# EAGLE board Titan_6L_v1p3 (EAGLE 9.6.2)
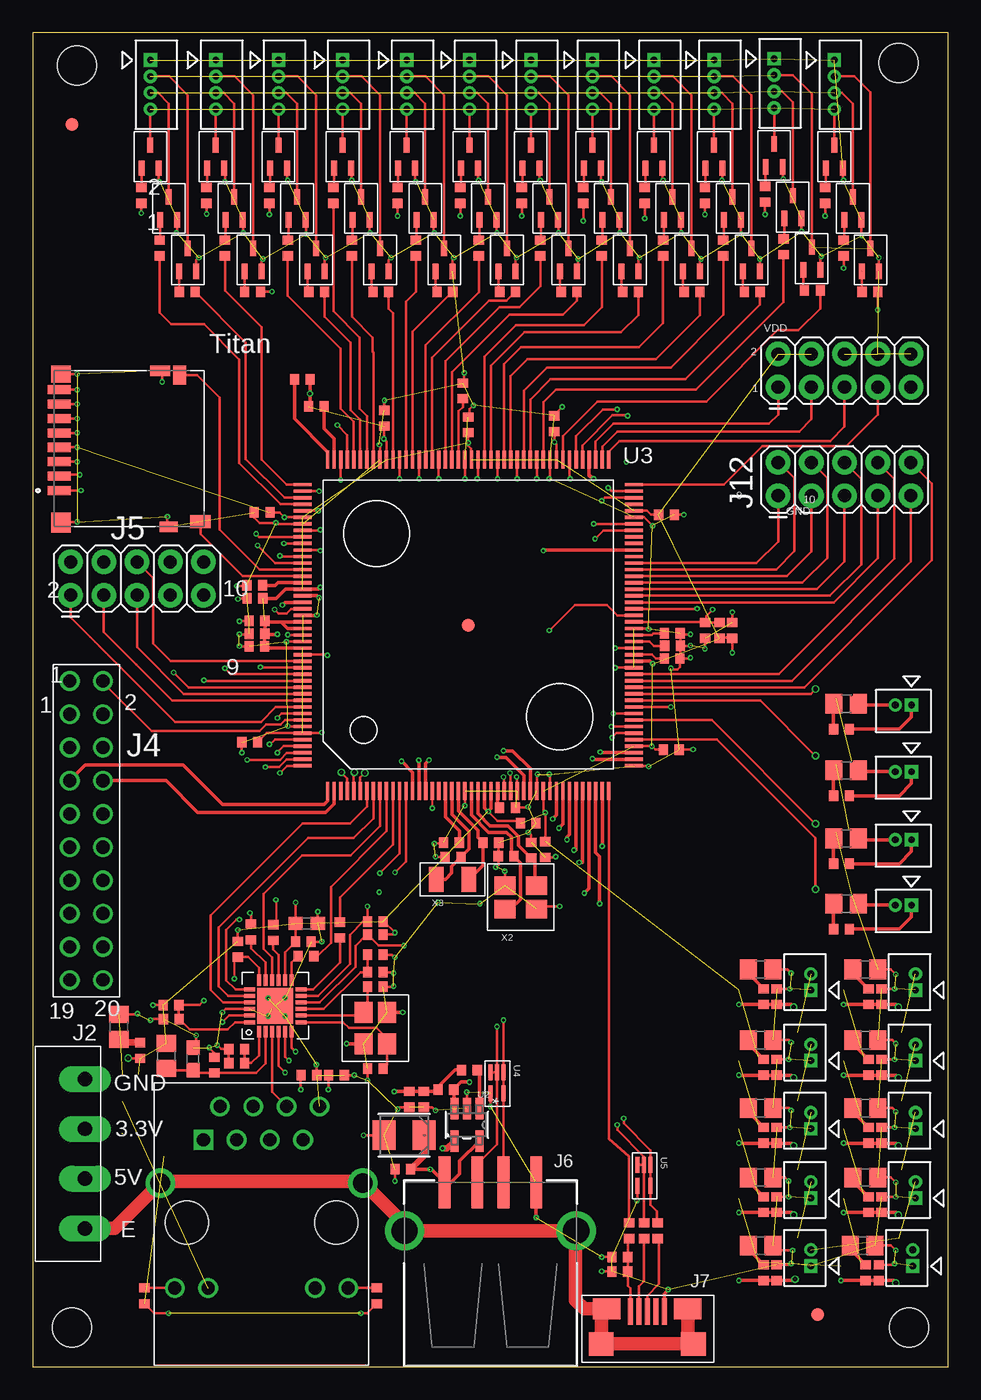
[diagram p7: board, top side]
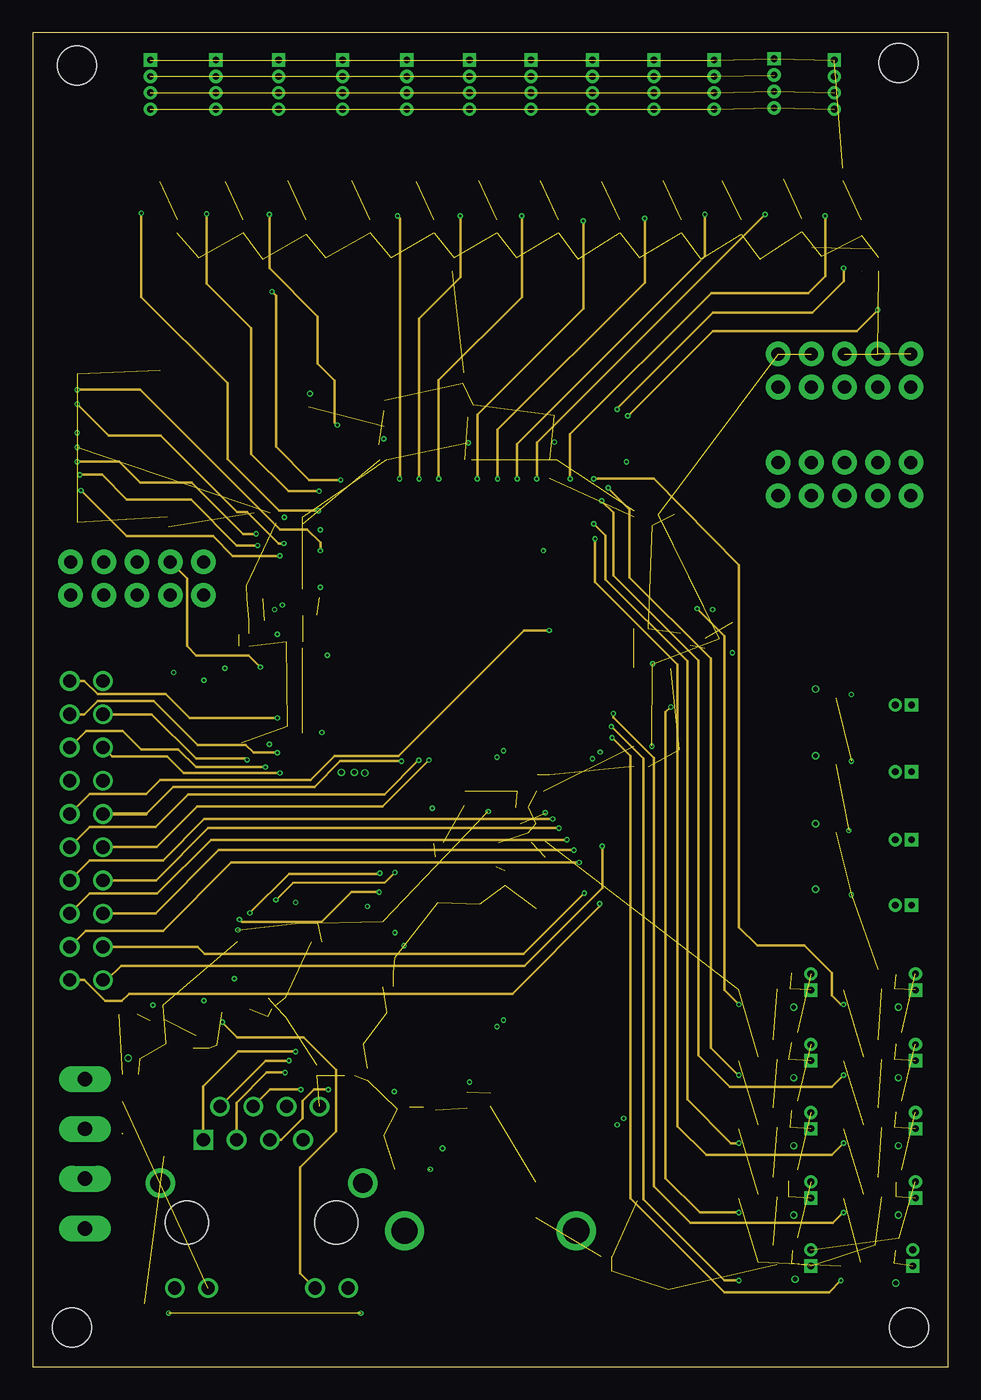
[diagram p8: board, inner layer Route3]
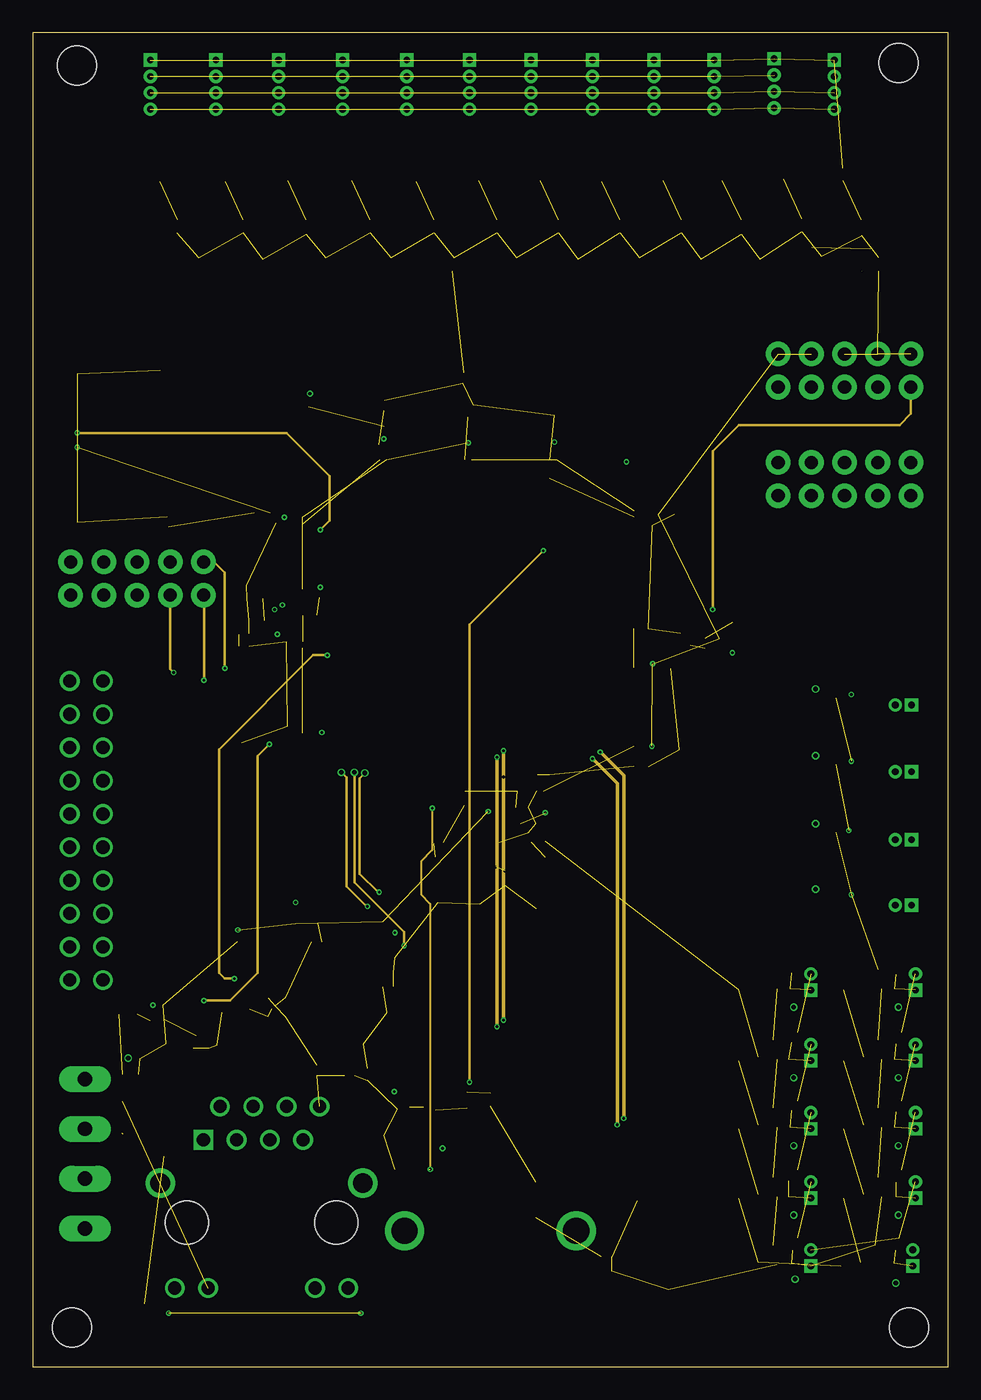
[diagram p9: board, inner layer Route14]
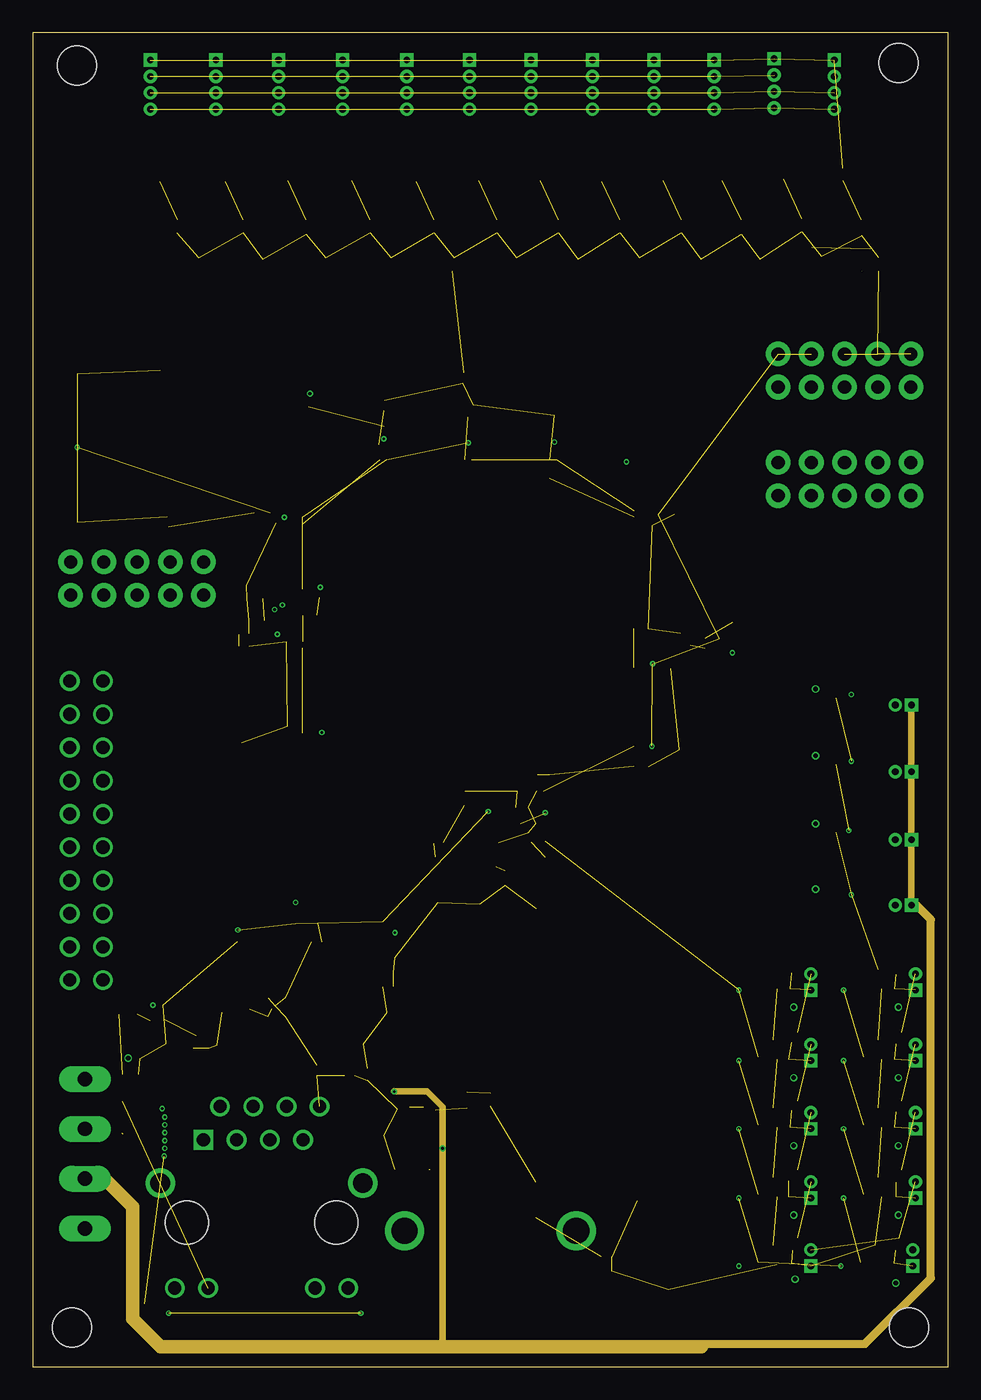
[diagram p10: board, inner layer VDD]
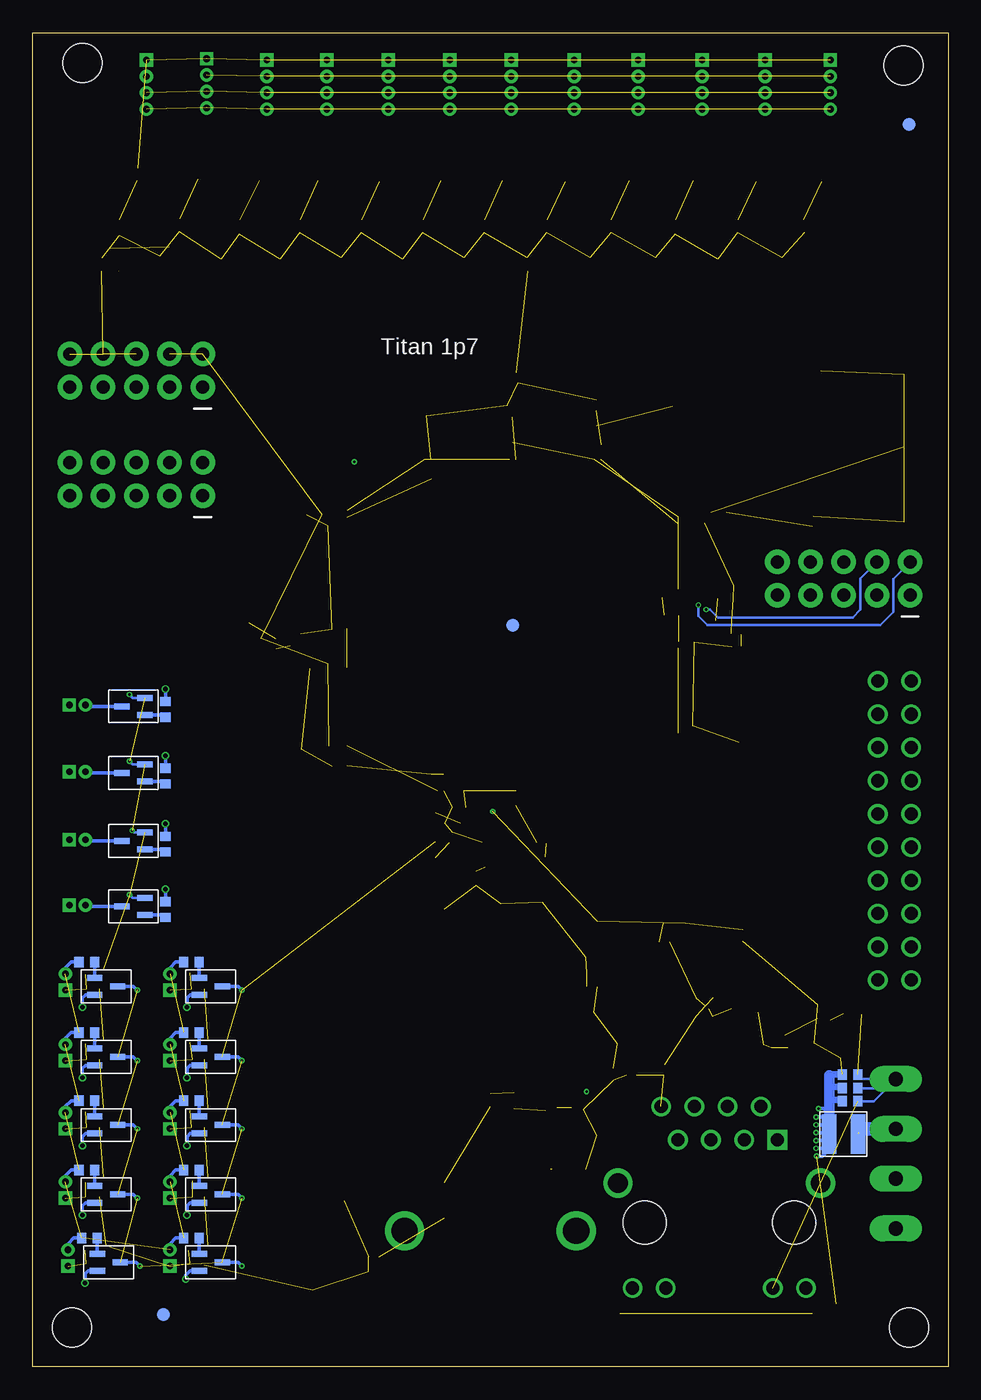
[diagram p11: board, bottom side, seen from below]

Size 70 x 102 mm. Coordinates in mm from the lower left corner, seen from the top.
Outline: 0,0 70,0 70,102 0,102 0,0
Copper layers ([3:[2:[15:1+2*3+14*15+16:2]:15]]): Top 0.0348mm / dielectric 0.1mm / GND 0.0348mm / dielectric 0.546mm / Route3 0.0348mm / dielectric 0.1mm / Route14 0.0348mm / dielectric 0.546mm / VDD 0.0348mm / dielectric 0.1mm / Bottom 0.0348mm
Design rules "default *": minimum track width 6mil, minimum drill 0.2mm, track to track 6mil, track to pad 6mil, pad to pad 6mil, via to via 6mil, smd to smd 6mil, copper to edge 40mil, drill to drill 6mil, minimum pad ring 10mil, minimum via ring 4mil, stop-mask expansion 4mil, vias tented up to drill 0mil, thermal gap 10mil
Holes 3 mm at 3.4,99.5 66.2,99.7 67,3 3,3

## Footprints (pad centres in the part's own frame; a part is rotated, then mirrored left to right if it is on the bottom)
FIDUCIAL_1MM = smd 1 x 1: 1 0,0
CAP_1210TJLJ_3P5X2P8_DIO-M = smd 1.753 x 2.261: 1 -1.537,0; 2 1.537,0
0402 = smd 0.8 x 0.7: P$1 0,0.6; P$2 0,-0.6
0603 = smd 1.1 x 1: 1 -0.85,0; 2 0.85,0
0805 = smd 1.3 x 1.5: 1 -0.95,0; 2 0.95,0
SD_CARD = smd 0.7 x 1.75: 1 3.2,-5.285; 2 2.1,-5.285; 3 1,-5.285; 4 -0.1,-5.285; 5 -1.2,-5.285; 6 -2.3,-5.285; 7 -3.4,-5.285; 8 -4.5,-5.285 | smd 1 x 1.55: 9 5.575,5.515 | smd 1.45 x 1: 10 -5.625,3.94 | smd 1.5 x 1.5: S1 5.65,-5.16 | smd 1.3 x 1.5: S2 -5.7,-5.16 | smd 0.8 x 1.4: S3 5.975,3.09 | smd 0.8 x 1.5: S4 -5.95,2.44
1X4_3.81MM_PITCH = drill 1.1 pad 2 long: P$1 0,0; P$2 3.81,0; P$3 7.62,0; P$4 11.43,0
2X5 = drill 1 pad 1.88: 1 0,0; 2 0,2.54; 3 2.54,0; 4 2.54,2.54; 5 5.08,0; 6 5.08,2.54; 7 7.62,0; 8 7.62,2.54; 9 10.16,0; 10 10.16,2.54
2_X_10_.1_INCH = drill 1: P$1 -11.43,-1.27; P$2 -11.43,1.27; P$3 -8.89,-1.27; P$4 -8.89,1.27; P$5 -6.35,-1.27; P$6 -6.35,1.27; P$7 -3.81,-1.27; P$8 -3.81,1.27; P$9 -1.27,-1.27; P$10 -1.27,1.27; P$11 1.27,-1.27; P$12 1.27,1.27; P$13 3.81,-1.27; P$14 3.81,1.27; P$15 6.35,-1.27; P$16 6.35,1.27; P$17 8.89,-1.27; P$18 8.89,1.27; P$19 11.43,-1.27; P$20 11.43,1.27
USB_A_SMT = smd 4 x 0.9: D+ 6.7,-1; D- 6.7,1; GND 6.7,-3.5; VBUS 6.7,3.5 | drill 2: SHLD1 3,-6.566; SHLD2 3,6.566
USB_MICRO-B = smd 0.4 x 2: P$1 -1.3,2.475; P$2 -0.65,2.475; P$3 0,2.475; P$4 0.65,2.475; P$5 1.3,2.475 | smd 2.1 x 1.6: P$6 -3.1,2.675; P$7 3.1,2.675 | smd 1.9 x 1.8: P$8 -3.525,0; P$9 3.525,0
CON_530470210_MOL = drill 0.508 pad 0.838 square: 1 0,0 | drill 0.508 pad 0.838: 2 -1.245,0
CON_530470410_MOL = drill 0.508 pad 0.838 square: 1 0,0 | drill 0.508 pad 0.838: 2 -1.245,0; 3 -2.489,0; 4 -3.759,0
1008 = smd 3 x 1.1: 1 0,1.1; 2 0,-1.1
SOT-23-5 = smd 1.626 x 0.61: 1 -1.245,0.95; 2 -1.245,0; 3 -1.245,-0.95; 4 1.245,-0.95; 5 1.245,0.95
LQFP176_24X24 = smd 1.372 x 0.254: 1 -12.675,10.75; 2 -12.675,10.25; 3 -12.675,9.75; 4 -12.675,9.25; 5 -12.675,8.75; 6 -12.675,8.25; 7 -12.675,7.75; 8 -12.675,7.25; 9 -12.675,6.75; 10 -12.675,6.25; 11 -12.675,5.75; 12 -12.675,5.25; 13 -12.675,4.75; 14 -12.675,4.25; 15 -12.675,3.75; 16 -12.675,3.25; 17 -12.675,2.75; 18 -12.675,2.25; 19 -12.675,1.75; 20 -12.675,1.25; 21 -12.675,0.75; 22 -12.675,0.25; 23 -12.675,-0.25; 24 -12.675,-0.75; 25 -12.675,-1.25; 26 -12.675,-1.75; 27 -12.675,-2.25; 28 -12.675,-2.75; 29 -12.675,-3.25; 30 -12.675,-3.75; 31 -12.675,-4.25; 32 -12.675,-4.75; 33 -12.675,-5.25; 34 -12.675,-5.75; 35 -12.675,-6.25; 36 -12.675,-6.75; 37 -12.675,-7.25; 38 -12.675,-7.75; 39 -12.675,-8.25; 40 -12.675,-8.75; 41 -12.675,-9.25; 42 -12.675,-9.75; 43 -12.675,-10.25; 44 -12.675,-10.75; 89 12.675,-10.75; 90 12.675,-10.25; 91 12.675,-9.75; 92 12.675,-9.25; 93 12.675,-8.75; 94 12.675,-8.25; 95 12.675,-7.75; 96 12.675,-7.25; 97 12.675,-6.75; 98 12.675,-6.25; 99 12.675,-5.75; 100 12.675,-5.25; 101 12.675,-4.75; 102 12.675,-4.25; 103 12.675,-3.75; 104 12.675,-3.25; 105 12.675,-2.75; 106 12.675,-2.25; 107 12.675,-1.75; 108 12.675,-1.25; 109 12.675,-0.75; 110 12.675,-0.25; 111 12.675,0.25; 112 12.675,0.75; 113 12.675,1.25; 114 12.675,1.75; 115 12.675,2.25; 116 12.675,2.75; 117 12.675,3.25; 118 12.675,3.75; 119 12.675,4.25; 120 12.675,4.75; 121 12.675,5.25; 122 12.675,5.75; 123 12.675,6.25; 124 12.675,6.75; 125 12.675,7.25; 126 12.675,7.75; 127 12.675,8.25; 128 12.675,8.75; 129 12.675,9.25; 130 12.675,9.75; 131 12.675,10.25; 132 12.675,10.75 | smd 0.254 x 1.372: 45 -10.75,-12.675; 46 -10.25,-12.675; 47 -9.75,-12.675; 48 -9.25,-12.675; 49 -8.75,-12.675; 50 -8.25,-12.675; 51 -7.75,-12.675; 52 -7.25,-12.675; 53 -6.75,-12.675; 54 -6.25,-12.675; 55 -5.75,-12.675; 56 -5.25,-12.675; 57 -4.75,-12.675; 58 -4.25,-12.675; 59 -3.75,-12.675; 60 -3.25,-12.675; 61 -2.75,-12.675; 62 -2.25,-12.675; 63 -1.75,-12.675; 64 -1.25,-12.675; 65 -0.75,-12.675; 66 -0.25,-12.675; 67 0.25,-12.675; 68 0.75,-12.675; 69 1.25,-12.675; 70 1.75,-12.675; 71 2.25,-12.675; 72 2.75,-12.675; 73 3.25,-12.675; 74 3.75,-12.675; 75 4.25,-12.675; 76 4.75,-12.675; 77 5.25,-12.675; 78 5.75,-12.675; 79 6.25,-12.675; 80 6.75,-12.675; 81 7.25,-12.675; 82 7.75,-12.675; 83 8.25,-12.675; 84 8.75,-12.675; 85 9.25,-12.675; 86 9.75,-12.675; 87 10.25,-12.675; 88 10.75,-12.675; 133 10.75,12.675; 134 10.25,12.675; 135 9.75,12.675; 136 9.25,12.675; 137 8.75,12.675; 138 8.25,12.675; 139 7.75,12.675; 140 7.25,12.675; 141 6.75,12.675; 142 6.25,12.675; 143 5.75,12.675; 144 5.25,12.675; 145 4.75,12.675; 146 4.25,12.675; 147 3.75,12.675; 148 3.25,12.675; 149 2.75,12.675; 150 2.25,12.675; 151 1.75,12.675; 152 1.25,12.675; 153 0.75,12.675; 154 0.25,12.675; 155 -0.25,12.675; 156 -0.75,12.675; 157 -1.25,12.675; 158 -1.75,12.675; 159 -2.25,12.675; 160 -2.75,12.675; 161 -3.25,12.675; 162 -3.75,12.675; 163 -4.25,12.675; 164 -4.75,12.675; 165 -5.25,12.675; 166 -5.75,12.675; 167 -6.25,12.675; 168 -6.75,12.675; 169 -7.25,12.675; 170 -7.75,12.675; 171 -8.25,12.675; 172 -8.75,12.675; 173 -9.25,12.675; 174 -9.75,12.675; 175 -10.25,12.675; 176 -10.75,12.675
DRL5 = smd 1.219 x 0.305: 1 -0.8,0.5; 2 -0.8,0; 3 -0.8,-0.5; 4 0.8,-0.5; 5 0.8,0.5
QFN-24-M = smd 0.864 x 0.305: 1 -1.968,1.25; 2 -1.968,0.75; 3 -1.968,0.25; 4 -1.968,-0.25; 5 -1.968,-0.75; 6 -1.968,-1.25; 13 1.968,-1.25; 14 1.968,-0.75; 15 1.968,-0.25; 16 1.968,0.25; 17 1.968,0.75; 18 1.968,1.25 | smd 0.305 x 0.864: 7 -1.25,-1.968; 8 -0.75,-1.968; 9 -0.25,-1.968; 10 0.25,-1.968; 11 0.75,-1.968; 12 1.25,-1.968; 19 1.25,1.968; 20 0.75,1.968; 21 0.25,1.968; 22 -0.25,1.968; 23 -0.75,1.968; 24 -1.25,1.968 | smd 2.743 x 2.743: 25 0,0
SOT323 = smd 0.457 x 1.168: 1 -0.65,-0.876; 2 0.65,-0.876; 3 0,0.876
RJ45_TH_ELEC = drill 1 square: 1 -4.45,-2.54 | drill 1: 2 -3.18,0; 3 -1.91,-2.54; 4 -0.635,0; 5 0.635,-2.54; 6 1.91,0; 7 3.17,-2.54; 8 4.445,0; 9 -6.63,-13.88; 10 -4.09,-13.88; 11 4.09,-13.88; 12 6.63,-13.88 | drill 1.5: 13 -7.75,-5.84; 14 7.75,-5.84 | hole 3.299: 5.715,-8.89; -5.715,-8.89
SMD_3225 = smd 1.6 x 1.4: 1 -1.2,-0.9; 2 1.2,-0.9; 3 1.2,0.9; 4 -1.2,0.9
SMD_X_2_PADS = smd 1.9 x 1.1: P$1 0,1.25; P$2 0,-1.25

## Placement (x,y rotation side)
AFID1  FIDUCIAL_1MM  [FIDUCIAL_1MM]  60,4 0 top
AFID2  FIDUCIAL_1MM  [FIDUCIAL_1MM]  3,95 0 top
AFID3  FIDUCIAL_1MM  [FIDUCIAL_1MM]  33.3,56.7 0 top
AFID4  FIDUCIAL_1MM  [FIDUCIAL_1MM]  60,4 0 bottom
AFID5  FIDUCIAL_1MM  [FIDUCIAL_1MM]  3,95 0 bottom
AFID6  FIDUCIAL_1MM  [FIDUCIAL_1MM]  33.3,56.7 0 bottom
C1  TLJT107M010R0900CAP_1210TJLJ_3P5X2P8_DIO-M  [CAP_1210TJLJ_3P5X2P8_DIO-M]  28.4,17.7 180 top
C4  0.1uF  [0402]  7.5,22.35 90 bottom
C5  10uF  [0402]  7.5,21.3 90 bottom
C7  0.1uF  [0402]  7.5,20.3 90 bottom
C13  0.1uF  [0402]  21.13,22.3 90 top
C14  0.1uF  [0402]  23.23,22.3 90 top
C15  24pF  [0402]  26.2,22.8 270 top
C16  10uF  [0402]  51.42,56.3 0 top
C17  18pF  [0402]  36.2,39.03 270 top
C18  18pF  [0402]  38.13,39.5 180 top
C19  0.1uF  [0402]  17,58.75 90 top
C20  0.1uF  [0402]  17.54,65.32 90 top
C21  1uF  [0402]  17.16,56.05 90 top
C22  0.1uF  [0402]  17.15,57.05 90 top
C23  10uF  [0402]  29.9,20.45 0 top
C24  0.1uF  [0402]  16.98,59.74 90 top
C25  0.1uF  [0402]  17.14,55.08 90 top
C26  0.1uF  [0402]  28.8,20.45 0 top
C27  0.1uF  [0402]  16.59,47.75 90 top
C28  1uF  [0402]  44.9,8.4 270 top
C29  0.1uF  [0402]  28.3,15.1 270 top
C30  0.1uF  [0402]  26.87,72.52 0 top
C32  12pF  [0402]  32.14,38.97 270 top
C33  0.1uF  [0402]  32.02,40.07 270 top
C34  0.1uF  [0402]  32.89,74.62 0 top
C35  0.1uF  [0402]  33.3,72.02 0 top
C36  0.1uF  [0402]  37.89,41.56 90 top
C37  12pF  [0402]  35.03,40.07 90 top
C38  0.1uF  [0402]  39.89,72.11 0 top
C39  0.1uF  [0402]  39.19,39.55 0 top
C40  0.1uF  [0402]  53.49,56.3 180 top
C41  1uF  [0402]  48.46,65.14 90 top
C42  0.1uF  [0402]  48.9,54.15 90 top
C43  0.1uF  [0402]  48.84,47.19 270 top
C44  24pF  [0402]  26.2,29.06 90 top
C45  22uF  [0603]  12.26,23.54 90 top
C46  0.1uF  [0402]  13.89,23.07 180 top
C47  2.2uF  [0402]  15.6,23.22 270 top
C48  .1uF  [0402]  15.6,24.3 270 top
C49  100pF  [0402]  26.2,30.16 90 top
C50  22uF  [0603]  20.95,33.9 0 top
C51  0.1uF  [0402]  20.7,32.5 90 top
FB2/2  [0805]  10.22,23.77 270 top
J1  SD_CARD  [SD_CARD]  7.31,70.2 270 top
J2  4-pos  [1X4_3.81MM_PITCH]  4,22 270 top
J3  10-pos  [2X5]  57,74.9 0 top
J4  20-pos  [2_X_10_.1_INCH]  4.1,41 270 top
J5  10-pos  [2X5]  2.9,59 0 top
J6  USB-A  [USB_A_SMT]  35,7.4 90 top
J7  USB-B-Micro  [USB_MICRO-B]  47,1.75 0 top
J9  [CON_530470210_MOL]  67.3,7.7 270 top
J10  CONN_530470410_PICOBLADE_X_4  [CON_530470410_MOL]  9,99.91 90 top
J11  [CON_530470210_MOL]  59.5,18.2 270 top
J12  10-pos  [2X5]  57,66.6 0 top
J13  CONN_530470410_PICOBLADE_X_4  [CON_530470410_MOL]  14,99.91 90 top
J14  CONN_530470410_PICOBLADE_X_4  [CON_530470410_MOL]  18.8,99.91 90 top
J15  CONN_530470410_PICOBLADE_X_4  [CON_530470410_MOL]  23.7,99.91 90 top
J16  CONN_530470410_PICOBLADE_X_4  [CON_530470410_MOL]  28.6,99.91 90 top
J17  CONN_530470410_PICOBLADE_X_4  [CON_530470410_MOL]  47.5,99.91 90 top
J18  CONN_530470410_PICOBLADE_X_4  [CON_530470410_MOL]  33.4,99.91 90 top
J19  CONN_530470410_PICOBLADE_X_4  [CON_530470410_MOL]  61.3,99.91 90 top
J20  CONN_530470410_PICOBLADE_X_4  [CON_530470410_MOL]  38.1,99.91 90 top
J21  CONN_530470410_PICOBLADE_X_4  [CON_530470410_MOL]  52.1,99.91 90 top
J22  CONN_530470410_PICOBLADE_X_4  [CON_530470410_MOL]  42.8,99.91 90 top
J23  [CON_530470210_MOL]  59.5,7.7 270 top
J24  CONN_530470410_PICOBLADE_X_4  [CON_530470410_MOL]  56.7,100.01 90 top
J25  [CON_530470210_MOL]  67.2,35.3 0 top
J26  [CON_530470210_MOL]  67.5,12.9 270 top
J27  [CON_530470210_MOL]  67.5,23.4 270 top
J28  [CON_530470210_MOL]  59.5,12.9 270 top
J30  [CON_530470210_MOL]  67.5,18.2 270 top
J31  [CON_530470210_MOL]  59.5,23.4 270 top
J32  [CON_530470210_MOL]  67.2,40.3 0 top
J33  [CON_530470210_MOL]  67.5,28.8 270 top
J35  [CON_530470210_MOL]  59.5,28.8 270 top
J36  [CON_530470210_MOL]  67.2,45.5 0 top
J38  [CON_530470210_MOL]  67.2,50.6 0 top
L1  2.2uH  [1008]  8,17.8 270 bottom
LED1  Green  [0805]  6.6,26 90 top
LED3  Green  [0805]  63.46,9.28 0 top
LED4  Green  [0805]  55.66,19.78 0 top
LED5  Green  [0805]  55.66,9.28 0 top
LED6  Green  [0805]  62.2,35.4 0 top
LED7  Green  [0805]  63.66,14.48 0 top
LED8  Green  [0805]  63.66,24.98 0 top
LED9  Green  [0805]  55.66,14.48 0 top
LED11  Green  [0805]  63.66,19.78 0 top
LED12  Green  [0805]  55.66,24.98 0 top
LED13  Green  [0805]  62.2,40.4 0 top
LED14  Green  [0805]  63.66,30.38 0 top
LED16  Green  [0805]  55.66,30.38 0 top
LED17  Green  [0805]  62.2,45.6 0 top
LED19  Green  [0805]  62.2,50.7 0 top
R5  470R0  [0402]  8.22,24.19 0 top
R13  10K0  [0402]  52.52,56.3 0 top
R14  1K0  [0402]  20.62,75.5 270 top
R15  1K0  [0402]  21.68,73.43 90 top
R16  15K0  [0402]  45.6,10.4 0 top
R17  27R0  [0402]  46.75,10.4 0 top
R18  27R0  [0402]  47.8,10.4 0 top
R19  10K0  [0402]  31.6,21.2 270 top
R20  10K0  [0402]  33.4,22.7 270 top
R21  30K0  [0402]  44.9,7.3 90 top
R22  2K2  [0402]  36.31,42.75 270 top
R23  10K0  [0402]  48.92,55.12 270 top
R24  10K0  [0402]  48.91,56.08 270 top
R25  470  [0402]  26.31,5.43 0 top
R26  470  [0402]  8.56,5.43 0 top
R27  500R0  [0402]  59.84,34.96 0 bottom
R28  33R0  [0402]  8.3,89.55 180 top
R29  33R0  [0402]  9.71,85.53 180 top
R30  33R0  [0402]  11.82,82.2 270 top
R31  33R0  [0402]  13.3,89.55 180 top
R32  33R0  [0402]  14.71,85.53 180 top
R33  33R0  [0402]  16.82,82.2 270 top
R34  33R0  [0402]  18.1,89.55 180 top
R35  33R0  [0402]  19.51,85.53 180 top
R36  33R0  [0402]  21.72,82.2 270 top
R37  33R0  [0402]  23,89.55 180 top
R38  33R0  [0402]  24.41,85.53 180 top
R39  33R0  [0402]  26.62,82.2 270 top
R40  33R0  [0402]  27.9,89.55 180 top
R41  33R0  [0402]  29.31,85.53 180 top
R42  33R0  [0402]  31.52,82.2 270 top
R43  33R0  [0402]  46.8,89.55 180 top
R44  33R0  [0402]  48.21,85.53 180 top
R45  33R0  [0402]  50.42,82.2 270 top
R46  33R0  [0402]  32.7,89.55 180 top
R47  33R0  [0402]  34.11,85.53 180 top
R48  33R0  [0402]  36.32,82.2 270 top
R49  33R0  [0402]  60.6,89.55 180 top
R50  33R0  [0402]  62.01,85.53 180 top
R51  33R0  [0402]  64.02,82.2 270 top
R52  33R0  [0402]  37.4,89.55 180 top
R53  33R0  [0402]  38.81,85.53 180 top
R54  33R0  [0402]  41.02,82.2 270 top
R55  33R0  [0402]  51.4,89.55 180 top
R56  33R0  [0402]  52.81,85.53 180 top
R57  33R0  [0402]  55.02,82.2 270 top
R58  33R0  [0402]  42.1,89.55 180 top
R59  33R0  [0402]  43.51,85.53 180 top
R60  33R0  [0402]  45.72,82.2 270 top
R61  2.2K  [0402]  65.66,9.85 90 bottom
R62  470R0  [0402]  63.7,7.2 0 top
R63  10K0  [0402]  64.7,7.2 0 top
R64  33R0  [0402]  56,89.65 180 top
R65  33R0  [0402]  57.41,85.63 180 top
R66  33R0  [0402]  59.62,82.3 270 top
R67  2.2K  [0402]  57.86,20.35 90 bottom
R68  470R0  [0402]  55.9,17.7 0 top
R69  10K0  [0402]  56.9,17.7 0 top
R70  2.2K  [0402]  57.86,9.85 90 bottom
R71  470R0  [0402]  55.9,7.2 0 top
R72  10K0  [0402]  56.9,7.2 0 top
R73  470R0  [0402]  61.84,33.46 90 top
R74  6k49  [0402]  26.2,31.51 270 top
R75  10K  [0402]  15.69,31.92 180 top
R76  2.2K  [0402]  65.86,15.05 90 bottom
R77  470R0  [0402]  63.9,12.4 0 top
R78  10K0  [0402]  64.9,12.4 0 top
R79  2.2K  [0402]  65.86,25.55 90 bottom
R80  470R0  [0402]  63.9,22.9 0 top
R81  10K0  [0402]  64.9,22.9 0 top
R82  2.2K  [0402]  57.86,15.05 90 bottom
R83  470R0  [0402]  55.9,12.4 0 top
R84  10K0  [0402]  56.9,12.4 0 top
R85  500R0  [0402]  59.84,39.96 0 bottom
R86  470R0  [0402]  61.84,38.46 90 top
R87  10K  [0402]  10.58,27.66 270 top
R88  2.2K  [0402]  65.86,20.35 90 bottom
R89  470R0  [0402]  63.9,17.7 0 top
R90  10K0  [0402]  64.9,17.7 0 top
R91  2.2K  [0402]  57.86,25.55 90 bottom
R92  470R0  [0402]  55.9,22.9 0 top
R93  10K0  [0402]  56.9,22.9 0 top
R94  1K50  [0402]  26.2,34.04 90 top
R95  500R0  [0402]  59.84,45.16 0 bottom
R96  470R0  [0402]  61.84,43.66 90 top
R97  2.2K  [0402]  65.86,30.95 90 bottom
R98  470R0  [0402]  63.9,28.3 0 top
R99  10K0  [0402]  64.9,28.3 0 top
R100  1K50  [0402]  26.2,33.04 90 top
R101  33  [0402]  23.5,33.4 0 top
R102  500R0  [0402]  59.84,50.26 0 bottom
R103  2.2K  [0402]  57.86,30.95 90 bottom
R104  470R0  [0402]  55.9,28.3 0 top
R105  10K0  [0402]  56.9,28.3 0 top
R106  470R0  [0402]  61.84,48.76 90 top
R107  33  [0402]  20.9,31.4 270 top
R108  33  [0402]  16.7,33.25 0 top
R109  33  [0402]  18.4,33.2 0 top
U2  AP2151DWG-7  [SOT-23-5]  33.2,18.5 270 top
U3  S7G2LQFP176  [LQFP176_24X24]  33.3,56.7 90 top
U4  TVS-Diode  [DRL5]  35.5,21.7 270 top
U5  TVS-Diode  [DRL5]  46.75,14.65 270 top
U6  KSZ8081RNACAQFN-24-M  [QFN-24-M]  18.55,27.6 90 top
U7  NPN  [SOT323]  64.18,7.99 270 bottom
U8  NPN  [SOT323]  56.38,18.49 270 bottom
U9  NPN  [SOT323]  8.99,92.52 0 top
U10  NPN  [SOT323]  10.41,88.57 0 top
U11  NPN  [SOT323]  11.86,84.63 0 top
U12  NPN  [SOT323]  13.99,92.52 0 top
U13  NPN  [SOT323]  15.41,88.57 0 top
U14  NPN  [SOT323]  16.86,84.63 0 top
U15  NPN  [SOT323]  18.79,92.52 0 top
U16  NPN  [SOT323]  20.21,88.57 0 top
U17  NPN  [SOT323]  21.66,84.63 0 top
U18  NPN  [SOT323]  23.69,92.52 0 top
U19  NPN  [SOT323]  25.11,88.57 0 top
U20  NPN  [SOT323]  26.56,84.63 0 top
U21  NPN  [SOT323]  28.59,92.52 0 top
U22  NPN  [SOT323]  30.01,88.57 0 top
U23  NPN  [SOT323]  31.46,84.63 0 top
U24  NPN  [SOT323]  47.49,92.52 0 top
U25  NPN  [SOT323]  48.91,88.57 0 top
U26  NPN  [SOT323]  50.36,84.63 0 top
U27  NPN  [SOT323]  33.39,92.52 0 top
U28  NPN  [SOT323]  34.81,88.57 0 top
U29  NPN  [SOT323]  36.26,84.63 0 top
U30  NPN  [SOT323]  61.29,92.52 0 top
U31  NPN  [SOT323]  62.71,88.57 0 top
U32  NPN  [SOT323]  64.06,84.63 0 top
U33  NPN  [SOT323]  38.09,92.52 0 top
U34  NPN  [SOT323]  39.51,88.57 0 top
U35  NPN  [SOT323]  40.96,84.63 0 top
U36  NPN  [SOT323]  52.09,92.52 0 top
U37  NPN  [SOT323]  53.51,88.57 0 top
U38  NPN  [SOT323]  54.96,84.63 0 top
U39  NPN  [SOT323]  42.79,92.52 0 top
U40  NPN  [SOT323]  44.21,88.57 0 top
U41  NPN  [SOT323]  45.66,84.63 0 top
U42  NPN  [SOT323]  56.38,7.99 270 bottom
U43  NPN  [SOT323]  62.3,35.2 90 bottom
U44  NPN  [SOT323]  64.38,13.19 270 bottom
U45  NPN  [SOT323]  56.69,92.62 0 top
U46  NPN  [SOT323]  58.11,88.67 0 top
U47  NPN  [SOT323]  59.56,84.73 0 top
U48  NPN  [SOT323]  64.38,23.69 270 bottom
U49  NPN  [SOT323]  56.38,13.19 270 bottom
U51  NPN  [SOT323]  64.38,18.49 270 bottom
U52  NPN  [SOT323]  56.38,23.69 270 bottom
U53  NPN  [SOT323]  62.3,40.2 90 bottom
U54  NPN  [SOT323]  64.38,29.09 270 bottom
U56  NPN  [SOT323]  56.38,29.09 270 bottom
U57  NPN  [SOT323]  62.3,45.4 90 bottom
U59  NPN  [SOT323]  62.3,50.5 90 bottom
U$2  [RJ45_TH_ELEC]  17.5,19.9 0 top
U$3  [SMD_3225]  26.2,25.9 270 top
U$4  10uF  [0402]  10.6,26.59 270 top
X2  24MHz  [SMD_3225]  37.31,35.89 0 top
X3  32.768KHz  [SMD_X_2_PADS]  32.1,37.26 90 top

## Tracks (layer width: path | path; a pad name or v marks a point on that pad's centre or on a via)
C58  (via drill 0.2 layers 1-3)
  Top 0.2: v20.5,21.2 20.5,22.31 C13.P$1
  Route3 0.2: U$2.4 18.16,21.2 v20.5,21.2
C60  (via drill 0.2 layers 1-3)
  Top 0.2: C14.P$1 22.63,21.23 v22.6,21.2
  Route3 0.2: v22.6,21.2 v22.59,21.21 21.53,21.21 20.64,20.32 20.64,19 18.99,17.36 U$2.5
CRS_DV
  Top 0.2: U6.15 18.8,31.5 18.4,31.9 R109.P$2
D+
  Top 0.2: R18.P$2 47.9,9.7 47.9,6.35 47,5.44 J7.P$3
D-
  Top 0.2: R17.P$2 46.75,6.55 46.35,6.15 J7.P$2
ESTOP  (via drill 0.2 layers 1-3, 0.35)
  Top 0.2: U3.69 50.78,57.95 v50.8,57.97
  Top 0.254: v58.2,27.5 58,27.7 R105.P$2 R104.P$2 v54,27.7
  Route3 0.2: v50.8,57.97 52.9,55.87 52.9,28.8 v54,27.7
  Bottom 0.254: v58.2,27.5 58.2,28.2 57.96,28.44 U56.2
ETH
  Top 0.2: U6.16 18.3,31.29 17.65,31.95 17.65,36.15 20.6,39.1 24.3,39.1 26.55,41.35 U3.9
ETH_CRS_DV  (via drill 0.2 layers 1-3)
  Top 0.152: v18.6,35.7 18.6,34 R109.P$1
  Top 0.2: v27.7,37.8 28.55,38.65 U3.13
  Route3 0.152: v18.6,35.7 19.9,37 26.9,37 v27.7,37.8
ETH_IRQ14  (via drill 0.2 layers 1-14)
  Top 0.152: v15.43,29.68 15.43,31.06 R75.P$1
  Top 0.2: v22.54,54.41 22.54,54.45 U3.159 | U6.18 17.3,30.5 16.48,31.32 R75.P$1
  Route14 0.2: v15.43,29.68 14.68,29.68 14.25,30.11 14.25,47.22 21.44,54.41 v22.54,54.41
ETH_MDC  (via drill 0.2 layers 1-14, 0.35 layers 1-14)
  Top 0.2: U6.11 21.81,28.35 24.27,30.81 24.27,33.03 25.28,34.04 R94.P$1 v25.6,35.2 | U3.4 24.05,44.99 v23.6,45.44
  Route14 0.2: v25.6,35.2 25.54,35.2 24,36.74 24,45.04 v23.6,45.44
ETH_MDIO  (via drill 0.2 layers 1-14, 0.35 layers 1-14)
  Top 0.2: U6.10 21.95,27.85 24.67,30.57 24.67,32.17 25.54,33.04 R100.P$1 26.44,32.2 v28.4,32.2 | U3.5 24.55,45.39 v24.6,45.44
  Route14 0.2: v28.4,32.2 28.4,33.24 24.6,37.04 v24.6,45.44
ETH_RESET  (via drill 0.2 layers 1-14)
  Top 0.2: U3.172 18.54,47.95 18.2,47.61 v18.1,47.61 | U6.24 15.48,26.35 14.92,25.79 12,25.79 U$4.P$1 11.18,26.61 R87.P$1 12.76,27.66 v13.1,28
  Route14 0.2: v13.1,28 15.1,28 17.2,30.1 17.2,46.71 v18.1,47.61
ETH_RX_ER  (via drill 0.2 layers 1-3)
  Top 0.2: v16.6,34.7 16.7,34.6 R108.P$1 | U3.12 28.05,39.25 v26.55,37.75
  Route3 0.2: v26.55,37.75 26.5,37.7 19.6,37.7 v16.6,34.7
ETH_RXD0
  Top 0.2: R107.P$1 21.8,31.4 22.8,32.4 22.8,36.7 27.05,40.95 U3.10
ETH_RXD1
  Top 0.2: U3.11 27.55,39.95 23.5,35.9 R101.P$1
ETH_TXD0
  Top 0.2: U6.20 14.95,28.35 14.2,29.1 14.2,33.58 21.05,40.42 24.55,40.42 26.05,41.92 U3.8
ETH_TXD1
  Top 0.2: U6.21 14.55,27.85 13.6,28.8 13.6,34.5 20.62,41.52 24.25,41.52 25.55,42.83 U3.7
ETH_TXD_EN  (via drill 0.2 layers 1-14, 0.2 layers 1-3, 0.35 layers 1-14)
  Top 0.2: U6.19 15.5,28.85 14.8,29.55 14.8,33.4 15.6,34.2 v15.8,34.2 | v25.4,45.4 25.05,45.05 U3.6
  Route3 0.2: v15.8,34.2 16,34 22.1,34 24.39,36.29 v26.49,36.29
  Route14 0.2: v26.49,36.29 26.39,36.29 25,37.69 25,45 v25.4,45.4
GND  (via drill 0.2 layers 1-2, 0.2 layers 2-16)  (170 unrouted)
  Top 0.152: U10.2 11.1,87.66 | U12.2 14.7,91.59 | U13.2 16.2,87.56
  Top 0.2: 18.3,27.35 U6.25 | v16,46.95 v15.99,46.96 C27.P$1 | C20.P$1 16.94,64.92 17.34,64.53 v18.6,64.53 18.68,64.45 U3.139 | C43.P$1 50.49,47.19 v50.5,47.2 | C42.P$2 49.5,53.5 49.3,53.3 48.9,53.3 v48.8,53.4 | R23.P$1 49.52,54.17 C42.P$2 | R23.P$1 R24.P$1 49.59,56 v50.3,56 | R22.P$1 37.85,42.75 v37.9,42.8 | C38.P$1 39.89,72.79 v40.5,73.4 | C13.P$2 21.7,22.33 v21.7,23.1 | C14.P$2 v24.6,22.3 | C15.P$2 v25.6,21.9 | U6.22 14.75,27.35 v14.5,27.1 | v14.1,24.6 14.4,24.3 C48.P$2 C47.P$2 | C45.2 12.5,24.63 v12.5,25.34 | C46.P$2 13.89,24.01 v13.5,24.4 | LED1.2 7.95,26.95 v8,27 | U$4.P$2 9.09,26.59 v9,26.5 | C44.P$2 27.56,29.06 v27.6,29.1 | C49.P$2 27.54,30.16 v27.6,30.1 | R74.P$1 27.49,31.51 v27.7,31.3 | C29.P$2 v27.7,14.2 | C1.2 v25.3,17.7 | C26.P$2 28.05,19.85 v27.9,19.7 | C23.P$2 30.55,19.85 v30.8,19.6 | U2.2 v33.2,21 | U4.4 v35,19.9 | C28.P$2 v43.5,8.4 | R21.P$1 v43.5,7.3 | U5.4 46.25,12.75 v46.2,12.7 | 56.9,8.99 LED5.2 56.99,8.9 v58.1,8.9 | 64.7,8.99 LED3.2 65.62,9.28 v66,8.9 | 64.9,14.19 LED7.2 65.62,14.48 v66,14.1 | R72.P$1 57.9,7.8 v58,7.9 | R63.P$1 65.8,7.8 v65.9,7.9 | R84.P$1 v57.8,13 | LED9.2 57.52,14.48 v57.8,14.2 | R78.P$1 v66,13 | R69.P$1 v57.9,18.3 | LED4.2 57.82,19.78 v58,19.6 | R90.P$1 v65.9,18.3 | LED11.2 65.72,19.78 v66,19.5 | R93.P$1 v57.8,23.5 | LED12.2 57.82,24.98 v58,24.8 | LED8.2 65.72,24.98 v66,24.7 | R81.P$1 v65.9,23.5 | R105.P$1 v57.9,28.9 | LED16.2 57.72,30.38 v58,30.1 | LED14.2 65.62,30.38 v66,30 | R99.P$1 v65.9,28.9 | U3.45 47.05,45.95 v47.1,45.9 | U3.60 v44.55,53.45 | U3.63 v44.55,54.95 | v44.55,54.95 | U3.66 47.05,56.45 v47.1,56.4 | v50.3,55.15 50.27,55.12 R23.P$1 | C16.P$2 51.42,54.92 v51.4,54.9 | C40.P$2 53.5,56.91 v53.5,57.7 | U3.83 46.75,64.95 v47.4,64.3
  Top 0.2: C41.P$2 v49.79,65.14 v49.8,65.15 | U3.98 39.55,67.95 v39.5,67.9 | C34.P$1 33,75.33 v33,76 | C35.P$1 33.4,72.72 33.4,73.22 v33.7,73.52 | U3.111 v33.05,67.9 | C30.P$1 26.87,73.87 v26.9,73.9 | U3.124 26.55,70.45 v26.5,70.5 | C24.P$1 16.33,59.7 v15.6,59.7 | C19.P$1 15.75,58.75 v15.7,58.7 | C22.P$1 16.5,57 v15.8,57 | C21.P$1 16.51,56 v15.8,56 | C25.P$1 15.82,55.08 v15.8,55.1 | U3.157 19.42,55.45 v19.4,55.43 | U3.156 19.52,55.95 v19.5,55.97 | U3.170 19.55,48.95 v19.5,49 | U3.22 33.05,42.92 v33.03,42.9 | U3.28 36.05,45.05 v36,45.1 | U3.29 36.55,45.35 v36.5,45.4 | U3.30 37.05,45.05 v37,45.1 | U3.33 38.55,45.25 v38.6,45.3 | U3.35 39.55,45.25 v39.5,45.3 | C39.P$2 39.95,38.95 v40,39 | C18.P$2 38.1,40.13 38.1,40.65 v37.9,40.85 | X2.2 38.72,35.2 v40.3,35.2 | X2.4 v36.11,37.89 v36.1,37.9 | v35.41,38.2 35.6,38.39 C17.P$2 35.63,39.06 C37.P$2 | C33.P$2 31.35,40 v30.7,40 | C32.P$2 30.83,38.97 v30.8,39 | C51.P$2 v22.1,32.5 | C50.2 v21.8,34.8 | U32.2 64.71,84.79 v64.7,84.8 | U47.2 60.21,84.81 v60.3,84.9 | U38.2 55.61,84.69 v55.6,84.7 | U31.2 63.36,86.54 v63.4,86.5 | U46.2 58.76,86.84 v58.8,86.8 | U37.2 54.16,86.64 v54.2,86.6 | U25.2 49.56,86.74 v49.6,86.7 | U40.2 44.86,86.74 v44.9,86.7 | U41.2 46.31,84.71 v46.4,84.8 | U26.2 51.01,84.61 v51.1,84.7 | U24.2 48.14,90.76 v48.2,90.7 | U36.2 52.74,90.74 v52.7,90.7 | U45.2 57.34,90.86 v57.4,90.8 | U30.2 61.94,90.76 v62,90.7 | U39.2 43.44,90.66 v43.5,90.6 | U33.2 38.74,90.76 v38.8,90.7 | U27.2 34.04,90.76 v34.1,90.7 | U21.2 29.24,90.66 v29.3,90.6 | U18.2 24.4,91.59 v24.4,90.7 | U15.2 19.44,90.76 v19.5,90.7 | 14.7,91.59 v14.7,90.6 | U13.2 16.1,87.66 v16.1,86.7 | U16.2 20.9,87.66 v20.9,86.6 | U19.2 25.76,86.74 v25.8,86.7
  Top 0.2: U22.2 30.66,86.74 v30.7,86.7 | U28.2 35.46,86.74 v35.5,86.7 | U34.2 40.2,87.66 v40.2,86.7 | U35.2 41.7,83.84 v41.7,84.7 | U29.2 36.91,84.71 v37,84.8 | U23.2 32.11,84.71 v32.2,84.8 | U20.2 27.21,84.61 v27.4,84.8 | U17.2 22.31,84.71 v22.4,84.8 | U14.2 17.51,84.61 v17.6,84.7 | U11.2 12.51,84.61 v12.7,84.8 | U9.2 9.64,90.66 v9.7,90.6 | U10.2 11.06,86.76 v11,86.7 | J1.6 v3.4,72.5 | J1.S2 v3.4,75.9 | J1.S4 9.9,76 v9.9,75.3 | J1.S1 2.2,64.6 v3.4,64.6 | J1.S3 10.3,64.33 v10.3,65 | C42.P$2 50.25,54.15 v50.3,54.2
  Top 0.254: U3.153 21.69,57.45 v21.72,57.48 | U3.150 21.75,58.95 v21.9,58.8 | U6.22 16.55,27.32 | U$3.4 v28.3,27.1 | U$3.2 v24,24.7 | J6.GND v38.5,11.4 | J7.P$5 48.3,5.6 v48.6,5.9
  Bottom 0.2: C4.P$2 6.55,22 J2.P$1 | C5.P$2 4.7,21.3 J2.P$1 | C7.P$2 5.7,20.3 J2.P$1 | U43.2 62.35,35.85 v62.6,36.1 | U53.2 62.25,40.85 v62.4,41 | U57.2 62.35,46.05 v62.6,46.3 | U59.2 62.35,51.15 v62.6,51.4
  other vias: 31,35.5 34.2,35.4 18,26.8 19.3,26.8 18,28.2 19.3,28.2
GNDE
  Top 1.016: J7.P$7 50.1,2.17 J7.P$9 J7.P$8 43.48,4.42 J7.P$6 42.17,4.42 41.5,5.1 41.5,10.33 J6.SHLD1 J6.SHLD2 28.43,10.88 U$2.14 24.65,14.06 24.53,14.18 10.47,14.18 10.35,14.06 U$2.13 6.26,10.57 J2.P$4
IIC_1_SCL
  Top 0.254: U3.132 22.55,69.95 20.02,72.48 R14.P$2
IIC_1_SDA
  Top 0.254: U3.131 23.05,70.95 22.29,71.72 R15.P$2
LED1/SPEED  (via drill 0.2 layers 1-3)
  Top 0.2: U6.23 15,26.85 v14.5,26.35
  Route3 0.2: v14.5,26.35 15.65,25.2 20.7,25.2 23.2,22.7 23.2,18 20.45,15.25 20.45,7.15 U$2.11
LS_01  (via drill 0.2 layers 1-3, 0.35)
  Top 0.2: U3.50 44.65,48.45 v44.3,48.1
  Top 0.254: v66,6.4 65.8,6.6 R63.P$2 R62.P$2 v61.8,6.6
  Route3 0.2: v61.8,6.6 60.9,5.7 52.9,5.7 45.7,12.9 45.7,46.7 v44.3,48.1
  Bottom 0.254: v66,6.4 66,7.1 65.76,7.34 U7.2
LS_02  (via drill 0.2 layers 1-3, 0.35)
  Top 0.2: U3.51 v44.25,48.95
  Top 0.254: v58.3,6.7 58.2,6.6 R72.P$2 R71.P$2 v54,6.6
  Route3 0.2: v54,6.6 52.9,6.6 46.7,12.8 46.7,46.5 v44.25,48.95
  Bottom 0.254: v58.3,6.7 58.3,7 57.96,7.34 U42.2
LS_03  (via drill 0.2 layers 1-3, 0.35)
  Top 0.2: U3.53 v44.4,49.95
  Top 0.254: v66.2,11.6 66,11.8 R78.P$2 R77.P$2 v62,11.8
  Route3 0.2: v62,11.8 61.2,11 50.3,11 47.5,13.8 47.5,46.55 44.4,49.65 v44.4,49.95
  Bottom 0.254: v66.2,11.6 66.2,12.3 65.96,12.54 U44.2
LS_04  (via drill 0.2 layers 1-3, 0.35)
  Top 0.2: U3.54 v48.8,50.45
  Top 0.254: v58.2,11.6 58,11.8 R84.P$2 R83.P$2 v54,11.8
  Route3 0.2: v48.8,50.45 48.4,50.05 48.4,14.4 51,11.8 v54,11.8
  Bottom 0.254: v58.2,11.6 58.2,12.3 57.96,12.54 U49.2
LS_05  (via drill 0.2 layers 1-3, 0.35)
  Top 0.2: U3.81 43.65,63.95 v43,63.3
  Top 0.254: v66.2,16.9 66,17.1 R90.P$2 R89.P$2 v62,17.1
  Route3 0.2: v43,63.3 43,60 49.3,53.7 49.3,18.4 51.5,16.2 61.1,16.2 v62,17.1
  Bottom 0.254: v66.2,16.9 66.2,17.6 65.96,17.84 U51.2
LS_06  (via drill 0.2 layers 1-3, 0.35)
  Top 0.2: U3.82 v42.9,64.45
  Top 0.254: v58.2,16.9 58,17.1 R69.P$2 R68.P$2 v54,17.1
  Route3 0.2: v42.9,64.45 43.8,63.55 43.8,60.2 50.05,53.95 50.05,20.45 53.4,17.1 v54,17.1
  Bottom 0.254: v58.2,16.9 58.2,17.6 57.96,17.84 U8.2
LS_07  (via drill 0.2 layers 1-3, 0.35)
  Top 0.2: U3.86 43.75,66.45 v43.5,66.2
  Top 0.254: v66.2,22.1 66,22.3 R81.P$2 R80.P$2 v62,22.3
  Route3 0.2: v43.5,66.2 44.4,65.3 44.4,60.5 50.9,54 50.9,23.8 53.3,21.4 61.1,21.4 v62,22.3
  Bottom 0.254: v66.2,22.1 66.2,22.8 65.96,23.04 U48.2
LS_08  (via drill 0.2 layers 1-3, 0.35)
  Top 0.2: U3.87 44.25,66.95 v44,67.2
  Top 0.254: v58.2,22.1 58,22.3 R93.P$2 R92.P$2 v54,22.3
  Route3 0.2: v54,22.3 53.95,22.3 51.85,24.4 51.85,54.15 45.65,60.35 45.65,65.55 v44,67.2
  Bottom 0.254: v58.2,22.1 58.2,22.8 57.96,23.04 U52.2
LS_09  (via drill 0.2 layers 1-3, 0.35)
  Top 0.254: U3.92 42.55,68.15 v42.9,67.9 | v66.2,27.5 66,27.7 R99.P$2 R98.P$2 v62,27.7
  Route3 0.2: v62,27.7 61.8,27.7 61.1,28.4 61.1,30.1 59,32.2 55.4,32.2 54,33.6 54,61.3 47.5,67.9 v42.9,67.9
  Bottom 0.254: v66.2,27.5 66.2,28.2 65.96,28.44 U54.2
LS_RET  (9 unrouted)
  Bottom 0.254: J9.2 67.3,9.41 66.86,9.85 R61.P$1 | J23.2 59.5,9.41 59.06,9.85 R70.P$1 | J26.2 67.5,14.61 67.06,15.05 R76.P$1 | J28.2 59.5,14.61 59.06,15.05 R82.P$1 | J30.2 67.5,19.91 67.06,20.35 R88.P$1 | J11.2 59.5,19.91 59.06,20.35 R67.P$1 | J27.2 67.5,25.11 67.06,25.55 R79.P$1 | J31.2 59.5,25.11 59.06,25.55 R91.P$1 | J33.2 67.5,30.51 67.06,30.95 R97.P$1 | J35.2 59.5,30.51 59.06,30.95 R103.P$1
M1_DIR
  Top 0.2: U3.136 18.95,65.95 15.8,69.1 15.8,77 13.1,79.7 10.6,79.7 9.71,80.59 R29.P$1
M1_ENABLE
  Top 0.2: U3.135 19.25,66.45 16.3,69.4 16.3,78.32 R30.P$1
M1_STEP  (via drill 0.2 layers 1-3)
  Top 0.2: U3.137 v21.85,65.45 | v8.3,88.2 R28.P$1
  Route3 0.2: v21.85,65.45 18.85,65.45 14.9,69.4 14.9,75.2 8.3,81.8 v8.3,88.2
M2_DIR
  Top 0.2: U3.133 19.43,67.45 17.5,69.38 17.5,79.5 14.71,82.29 R32.P$1
M2_ENABLE  (via drill 0.2 layers 1-3)
  Top 0.2: U3.130 v23.55,67.8 | v18.3,82.2 R33.P$1
  Route3 0.2: v23.55,67.8 21.15,67.8 18.6,70.35 18.6,81.9 v18.3,82.2
M2_STEP  (via drill 0.2 layers 1-3)
  Top 0.2: U3.134 v21.9,66.95 | v13.3,88.15 R31.P$1
  Route3 0.2: v21.9,66.95 19.55,66.95 16.7,69.8 16.7,79.4 13.3,82.8 v13.3,88.15
M3_DIR
  Top 0.2: U3.128 24.55,72.25 23.55,73.25 23.55,77.85 19.51,81.89 R35.P$1
M3_ENABLE
  Top 0.2: U3.127 25.05,72.4 24.3,73.15 24.3,78.3 22.32,80.28 R36.P$1
M3_STEP  (via drill 0.2 layers 1-3)
  Top 0.2: U3.129 24.05,71.25 v23.3,72 | v18.1,88.1 R34.P$1
  Route3 0.2: v23.3,72 23.1,72.2 23.1,75.4 21.8,76.7 21.8,80.3 18.1,84 v18.1,88.1
M4_DIR
  Top 0.2: U3.125 26.05,77.55 26,77.6 26,78.7 24.41,80.29 R38.P$1
M4_ENABLE
  Top 0.2: R39.P$1 27.22,80.9 27.55,80.57 U3.122
M4_STEP
  Top 0.2: U3.126 25.55,72.7 25,73.25 25,78.7 23,80.7 R37.P$1
M5_DIR
  Top 0.2: R41.P$1 29.31,82.21 28.55,81.45 U3.120
M5_ENABLE
  Top 0.2: R42.P$1 29.05,79.13 U3.119
M5_STEP  (via drill 0.2 layers 1-3)
  Top 0.2: U3.121 v28.05,67.9 | v27.9,88 R40.P$1
  Route3 0.2: v28.05,67.9 28.1,67.95 28.1,87.8 v27.9,88
M6_DIR
  Top 0.2: U3.117 30.05,78.1 34.11,82.16 R47.P$1
M6_ENABLE
  Top 0.2: U3.116 30.55,77.15 34.9,81.5 36.22,81.5 R48.P$1
M6_STEP  (via drill 0.2 layers 1-3)
  Top 0.2: U3.118 v29.55,67.9 | v32.7,88 R46.P$1
  Route3 0.2: v32.7,88 32.7,83.3 29.55,80.15 v29.55,67.9
M7_DIR
  Top 0.2: U3.114 31.55,76.9 35.68,81.03 37.21,81.03 38.81,82.63 R53.P$1
M7_ENABLE
  Top 0.2: U3.113 32.05,76.05 36.45,80.45 40.55,80.45 41.62,81.52 R54.P$1
M7_STEP  (via drill 0.2 layers 1-3)
  Top 0.2: U3.115 v31.05,67.9 | v37.4,88 R52.P$1
  Route3 0.2: v31.05,67.9 31.05,75.45 37.4,81.8 v37.4,88
M8_DIR
  Top 0.2: R59.P$1 43.51,81.01 42.15,79.65 36.95,79.65 34.55,77.25 U3.108
M8_ENABLE
  Top 0.2: R60.P$1 46.32,80.42 45,79.1 37.6,79.1 35.05,76.55 U3.107
M8_STEP  (via drill 0.2 layers 1-3)
  Top 0.2: U3.109 34.05,67.95 v34,67.9 | v42.1,87.6 R58.P$1
  Route3 0.2: v34,67.9 34,72.8 42.1,80.9 v42.1,87.6
M9_DIR
  Top 0.2: R44.P$1 48.21,79.81 46.35,77.95 37.35,77.95 36.05,76.65 U3.105
M9_ENABLE
  Top 0.2: R45.P$1 51.02,80.4 47.67,77.05 37.85,77.05 36.55,75.75 U3.104
M9_STEP  (via drill 0.2 layers 1-3)
  Top 0.2: U3.106 v35.55,67.9 | v46.8,87.8 R43.P$1
  Route3 0.2: v35.55,67.9 35.55,71.65 46.8,82.9 v46.8,87.8
M10_DIR
  Top 0.2: R56.P$1 52.83,84.91 52.83,80.43 48.81,76.41 39.31,76.41 37.55,74.65 U3.102
M10_ENABLE
  Top 0.2: R57.P$1 55.62,81.2 49.92,75.5 39.6,75.5 38.05,73.95 U3.101
M10_STEP  (via drill 0.2 layers 1-3)
  Top 0.2: U3.103 v37.05,67.9 | v51.4,88.1 R55.P$1
  Route3 0.2: v37.05,67.9 37.05,70.55 51.4,84.9 v51.4,88.1
M11_DIR
  Top 0.2: R65.P$1 57.41,81.41 50.7,74.7 40,74.7 39.05,73.75 U3.99
M11_ENABLE
  Top 0.2: U3.96 40.55,71.15 43.2,73.8 51.5,73.8 56.95,79.25 58.55,79.25 60.22,80.92 R66.P$1
M11_STEP  (via drill 0.2 layers 1-3)
  Top 0.2: U3.100 v38.55,67.9 | v56,88.1 R64.P$1
  Route3 0.2: v38.55,67.9 38.55,70.65 v56,88.1
M12_DIR  (via drill 0.2 layers 1-3)
  Top 0.2: U3.94 41.55,71.15 43.6,73.2 v44.7,73.2 | v62.01,84 R50.P$1
  Route3 0.2: v44.7,73.2 44.7,73.28 52.02,80.6 59.61,80.6 62.01,83 v62.01,84
M12_ENABLE  (via drill 0.2 layers 1-3)
  Top 0.2: U3.93 42.05,70.45 44.35,72.75 45.45,72.75 v45.5,72.7 | v64.62,80.8 R51.P$1
  Route3 0.2: v45.5,72.7 45.52,72.7 52.02,79.2 63.02,79.2 v64.62,80.8
M12_STEP  (via drill 0.2 layers 1-3)
  Top 0.2: U3.95 41.05,68.05 v41.1,67.9 | v60.6,88 R49.P$1
  Route3 0.2: v60.6,88 60.6,83.4 59.3,82.1 51.9,82.1 41.1,71.3 v41.1,67.9
MO_DIR  (11 unrouted)
  Top 0.2: U10.3 10.41,96.59 9.58,97.42 J10.3 | U13.3 15.41,96.59 14.58,97.42 J13.3 | U16.3 20.21,96.59 19.38,97.42 J14.3 | U19.3 25.11,96.59 24.28,97.42 J15.3 | U22.3 30.01,96.59 29.18,97.42 J16.3 | U28.3 34.81,96.59 33.98,97.42 J18.3 | U34.3 39.51,96.59 38.68,97.42 J20.3 | U40.3 44.21,96.59 43.38,97.42 J22.3 | U25.3 48.91,96.59 48.08,97.42 J17.3 | U37.3 53.51,96.59 52.68,97.42 J21.3 | U46.3 58.11,96.69 57.28,97.52 J24.3 | U31.3 62.71,96.59 61.88,97.42 J19.3
MO_ENABLE  (11 unrouted)
  Top 0.2: 11.86,88.21 U11.3 11.86,97.24 10.44,98.66 J10.2 | 16.86,88.21 U14.3 16.86,97.24 15.44,98.66 J13.2 | 21.66,88.21 U17.3 21.66,97.24 20.24,98.66 J14.2 | 26.56,88.21 U20.3 26.56,97.24 25.14,98.66 J15.2 | 31.46,88.21 U23.3 31.46,97.24 30.04,98.66 J16.2 | 36.26,88.21 U29.3 36.26,97.24 34.84,98.66 J18.2 | 40.96,88.21 U35.3 40.96,97.24 39.54,98.66 J20.2 | 45.66,88.21 U41.3 45.66,97.24 44.24,98.66 J22.2 | 50.36,88.21 U26.3 50.36,97.24 48.94,98.66 J17.2 | 54.96,88.21 U38.3 54.96,97.24 53.54,98.66 J21.2 | 59.56,88.31 U47.3 59.56,97.34 58.14,98.76 J24.2 | U32.3 64.06,97.44 62.84,98.66 J19.2
MO_STEP  (11 unrouted)
  Top 0.2: U9.3 J10.4 | U12.3 J13.4 | U15.3 J14.4 | U18.3 J15.4 | U21.3 J16.4 | U27.3 J18.4 | U33.3 J20.4 | U39.3 J22.4 | U24.3 J17.4 | U36.3 J21.4 | U45.3 J24.4 | U30.3 J19.4
N$1
  Top 0.254: U3.148 18.75,59.95 18.54,59.74 C24.P$2
N$3
  Top 0.508: R5.P$1 6.86,24.79 LED1.1
N$4
  Top 0.254: C33.P$1 32.62,40.97 31.55,42.05 U3.19
N$5
  Top 0.2: U3.62 47.35,54.45 47.65,54.15 C42.P$1
N$6
  Top 0.2: U3.64 47.15,55.45 47.5,55.1 48.3,55.1 R23.P$2
N$7
  Top 0.2: U3.65 47.35,55.95 47.48,56.08 R24.P$2
N$8
  Top 0.254: U3.27 35.55,42.91 R22.P$2
N$11
  Bottom 0.254: U7.1 R61.P$2
N$12
  Top 0.2: U10.1 9.76,86.19 R29.P$2
N$13
  Top 0.2: U11.1 11.21,82.3 R30.P$2
N$14
  Top 0.2: U9.1 8.34,90.2 R28.P$2
N$15
  Top 0.2: U13.1 14.76,86.19 R32.P$2
N$16
  Top 0.2: U14.1 16.21,82.3 R33.P$2
N$17
  Top 0.2: U12.1 13.34,90.2 R31.P$2
N$18
  Top 0.2: U16.1 19.56,86.19 R35.P$2
N$19
  Top 0.2: U17.1 21.01,82.3 R36.P$2
N$20
  Top 0.2: U15.1 18.14,90.2 R34.P$2
N$21
  Top 0.2: U19.1 24.46,86.19 R38.P$2
N$22
  Top 0.2: U20.1 25.91,82.3 R39.P$2
N$23
  Top 0.2: U18.1 23.04,90.2 R37.P$2
N$24
  Top 0.2: U22.1 29.36,86.19 R41.P$2
N$25
  Top 0.2: U23.1 30.81,82.3 R42.P$2
N$26
  Top 0.2: U21.1 27.94,90.2 R40.P$2
N$27
  Top 0.2: U25.1 48.26,86.19 R44.P$2
N$28
  Top 0.2: U26.1 49.71,82.3 R45.P$2
N$29
  Top 0.2: U24.1 46.84,90.2 R43.P$2
N$30
  Top 0.2: U28.1 34.16,86.19 R47.P$2
N$31
  Top 0.2: U29.1 35.61,82.3 R48.P$2
N$32
  Top 0.2: U27.1 32.74,90.2 R46.P$2
N$33
  Top 0.2: U31.1 62.06,86.19 R50.P$2
N$34  (1 unrouted)
  Top 0.2: R51.P$2 U32.1
N$35
  Top 0.2: U30.1 60.64,90.2 R49.P$2
N$36
  Top 0.2: U34.1 38.86,86.19 R53.P$2
N$37
  Top 0.2: U35.1 40.31,82.3 R54.P$2
N$38
  Top 0.2: U33.1 37.44,90.2 R52.P$2
N$39
  Top 0.2: U37.1 52.86,86.19 R56.P$2
N$40
  Top 0.2: U38.1 54.31,82.3 R57.P$2
N$41
  Top 0.2: U36.1 51.44,90.2 R55.P$2
N$42
  Top 0.2: U40.1 43.56,86.19 R59.P$2
N$43
  Top 0.2: U41.1 45.01,82.3 R60.P$2
N$44
  Top 0.2: U39.1 42.14,90.2 R58.P$2
N$45
  Top 0.254: R62.P$1 62.51,8.99 LED3.1
N$46
  Bottom 0.254: U8.1 R67.P$2
N$47
  Top 0.254: R68.P$1 54.71,19.49 LED4.1
N$48
  Top 0.2: U46.1 57.46,86.29 R65.P$2
N$49
  Top 0.2: U47.1 58.91,82.4 R66.P$2
N$50
  Top 0.2: U45.1 56.04,90.3 R64.P$2
N$51
  Bottom 0.254: U42.1 R70.P$2
N$52
  Top 0.254: R71.P$1 54.71,8.99 LED5.1
N$54
  Bottom 0.254: U43.1 60.03,34.55 R27.P$2
N$55
  Bottom 0.254: U44.1 R76.P$2
N$56
  Top 0.254: R77.P$1 62.71,14.19 LED7.1
N$57
  Bottom 0.254: U48.1 R79.P$2
N$58
  Top 0.254: R80.P$1 62.71,24.69 LED8.1
N$59
  Bottom 0.254: U49.1 R82.P$2
N$60
  Top 0.254: R83.P$1 54.71,14.19 LED9.1
N$61
  Top 0.254: J25.2 63.25,35.3 LED6.2
  Bottom 0.254: U43.3 65.86,35.2 J25.2
N$62
  Top 0.254: R73.P$1 LED6.1
N$63
  Bottom 0.254: U51.1 R88.P$2
N$64
  Top 0.254: R89.P$1 62.71,19.49 LED11.1
N$65
  Bottom 0.254: U52.1 R91.P$2
N$66
  Top 0.254: R92.P$1 54.71,24.69 LED12.1
N$68  (via drill 0.2)
  other vias: 45.4,69.2
N$69
  Bottom 0.254: U54.1 R97.P$2
N$70
  Top 0.254: R98.P$1 62.71,30.09 LED14.1
N$72
  Bottom 0.254: U53.1 60.03,39.55 R85.P$2
N$73
  Bottom 0.254: U56.1 R103.P$2
N$74
  Top 0.254: R104.P$1 54.71,30.09 LED16.1
N$75
  Top 0.254: J32.2 63.25,40.3 LED13.2
  Bottom 0.254: U53.3 65.86,40.2 J32.2
N$76
  Top 0.254: R86.P$1 LED13.1
N$80
  Bottom 0.254: U57.1 60.03,44.75 R95.P$2
N$81
  Top 0.254: J36.2 63.25,45.5 LED17.2
  Bottom 0.254: U57.3 65.86,45.4 J36.2
N$82
  Top 0.254: R96.P$1 LED17.1
N$86
  Bottom 0.254: U59.1 60.03,49.85 R102.P$2
N$87
  Top 0.254: J38.2 63.25,50.6 LED19.2
  Bottom 0.254: U59.3 65.86,50.5 J38.2
N$88
  Top 0.254: R106.P$1 LED19.1
P0_00
  Top 0.2: U3.169 19.3,49.45 18.95,49.1 17.86,49.1 17.36,48.6 9.1,48.6 5.37,52.33 J4.P$2
P0_01  (via drill 0.2 layers 1-3)
  Top 0.2: U3.168 19.05,49.95 v18.7,49.6
  Route3 0.2: v18.7,49.6 12,49.6 10.18,51.42 4.95,51.42 3.95,52.43 J4.P$1
P0_02
  Top 0.2: J5.1 2.9,57.3 10.9,49.3 17.46,49.3 18.59,50.43 20.55,50.43 20.57,50.45 U3.167
P0_03
  Top 0.2: U3.166 10.65,50.95 7.9,53.7 5.44,56.16 J5.3
P0_04
  Top 0.2: U3.165 11.55,51.45 7.98,55.02 J5.5
P0_05  (via drill 0.2 layers 1-14)
  Top 0.2: U3.164 11.91,51.95 v10.78,53.08
  Route14 0.2: v10.78,53.08 10.52,53.34 J5.7
P0_06  (via drill 0.2 layers 1-14)
  Top 0.2: U3.163 13.15,52.45 v13.1,52.5
  Route14 0.2: v13.1,52.5 13.1,58.96 J5.9
P0_07  (via drill 0.2 layers 1-14)
  Top 0.2: U3.162 15.15,52.95 v14.7,53.4
  Route14 0.2: v14.7,53.4 14.67,53.43 14.67,60.73 13.86,61.54 J5.10
P0_08  (via drill 0.2 layers 1-3)
  Top 0.2: U3.161 17.45,53.45 v17.4,53.5
  Route3 0.2: v17.4,53.5 16.5,54.4 12.5,54.4 11.8,55.1 11.8,60.26 J5.8
P0_09
  Top 0.2: U3.160 10.55,53.95 9.2,55.3 9.2,60.32 J5.6
P0_14  (via drill 0.2)
  Top 0.2: v18.5,57.9 18.8,57.6 19.4,57.6 19.75,57.95 U3.152
  Bottom 0.2: v18.5,57.9 18.2,57.9 17.6,57.3 7.3,57.3 6.7,57.9 6.7,60.28 J5.4
P0_15  (via drill 0.2)
  Top 0.254: v19.1,58.24 19.31,58.45 U3.151
  Bottom 0.2: J5.2 4.2,60.24 4.2,57.7 5.2,56.7 18.4,56.7 19.1,57.4 v19.1,58.24
P2_01  (via drill 0.2 layers 1-3)
  Top 0.2: U3.68 44.73,57.45 43.92,58.26 41.46,58.26 v39.5,56.3
  Route3 0.2: J4.P$9 4.36,43.8 8.69,43.8 9.74,44.85 21.25,44.85 23.1,46.7 27.97,46.7 37.57,56.3 v39.5,56.3
P3_10
  Top 0.2: U3.76 55.35,61.45 57,63.1 J12.1
P3_11
  Top 0.2: U3.75 56.85,60.95 58.25,62.35 58.25,67.95 57.06,69.14 J12.2
P3_12
  Top 0.2: U3.74 57.65,60.45 59.54,62.34 J12.3
P3_15
  Top 0.2: U3.57 59.01,51.95 68.76,61.7 68.76,67.54 J12.10
P4_00
  Top 0.254: U3.1 22.55,43.25 22.3,43 14.51,43 11.5,46.01 4.03,46.01 J4.P$7
P4_01
  Top 0.254: U3.2 23.05,43.05 22.4,42.4 12.61,42.4 10.2,44.81 J4.P$8
P4_08  (via drill 0.2 layers 1-3)
  Top 0.254: U3.43 v43.55,39.8
  Route3 0.2: J4.P$20 5.67,29.57 6.77,30.67 37.62,30.67 43.55,36.6 v43.55,39.8
P4_09  (via drill 0.2 layers 1-3)
  Top 0.254: U3.42 43.05,39.31 43.35,39.01 v43.35,35.41
  Route3 0.2: v43.35,35.41 43.35,35.21 36.67,28.53 7.38,28.53 6.82,27.97 5.55,27.97 3.95,29.57 J4.P$19
P4_10  (via drill 0.2 layers 1-3)
  Top 0.254: U3.41 42.55,36.58 v42.19,36.22
  Route3 0.2: J4.P$18 12.6,32.11 13.14,31.57 37.4,31.57 37.53,31.57 v42.19,36.22
P4_11  (via drill 0.2 layers 1-3)
  Top 0.254: U3.40 42.05,38.56 v41.8,38.56
  Route3 0.2: v41.8,38.56 15.19,38.56 9.98,33.34 4.06,33.34 J4.P$17
P4_12  (via drill 0.2 layers 1-3)
  Top 0.254: v41.39,39.5 41.55,39.5 U3.39
  Route3 0.2: v41.39,39.5 14.23,39.5 9.38,34.65 J4.P$16
P4_13  (via drill 0.2 layers 1-3)
  Top 0.254: U3.38 41.05,40.69 40.86,40.5 v40.86,40.3
  Route3 0.2: v40.86,40.3 13.64,40.3 9.52,36.18 4.36,36.18 J4.P$15
P4_14  (via drill 0.2 layers 1-3)
  Top 0.254: v40.24,41.19 40.55,41.49 U3.37
  Route3 0.2: v40.24,41.19 13.43,41.19 9.43,37.19 J4.P$14
P4_15  (via drill 0.2 layers 1-3)
  Top 0.254: U3.36 40.05,42.18 v39.76,41.89
  Route3 0.2: v39.76,41.89 13.12,41.89 9.96,38.72 4.36,38.72 J4.P$13
P5_11  (via drill 0.2 layers 1-3)
  Top 0.2: U3.176 19.45,45.95 v18.9,45.4
  Route3 0.2: J4.P$6 6.07,46.65 10.29,46.65 11.54,45.4 v18.9,45.4
P5_12  (via drill 0.2 layers 1-3)
  Top 0.2: U3.175 20.61,46.43 19.43,46.43 18.86,45.85 v17.8,45.85
  Route3 0.2: v17.8,45.85 12.49,45.85 11.13,47.21 8.29,47.21 6.9,48.6 4.08,48.6 J4.P$5
P5_13  (via drill 0.2 layers 1-3)
  Top 0.2: U3.174 20.61,46.93 19.43,46.93 18.9,46.4 v16.4,46.4
  Route3 0.2: v16.4,46.4 16.3,46.5 12.5,46.5 9.11,49.89 J4.P$4
P7_06  (via drill 0.2 layers 1-3)
  Top 0.254: U3.14 29.05,45.46 v28.21,46.3
  Route3 0.2: 8.67,42.27 10.75,44.35 21.55,44.35 23.5,46.3 v28.21,46.3
  Route3 0.254: J4.P$10 8.67,42.27
P7_07  (via drill 0.2 layers 1-3)
  Top 0.254: U3.15 29.55,46.35 v29.52,46.38
  Route3 0.2: v29.52,46.38 26.9,43.76 12.96,43.76 11.9,43.76 9.4,41.26 4.36,41.26 J4.P$11
P8_05  (via drill 0.2 layers 1-3)
  Top 0.2: U3.173 19.19,47.45 v18.7,46.96
  Route3 0.2: J4.P$3 3.95,49.89 4.95,50.9 9.26,50.9 12.6,47.56 16.3,47.56 16.9,46.96 v18.7,46.96
P9_00
  Top 0.2: U3.58 58.05,52.45 67.16,61.56 J12.9
P9_01
  Top 0.2: U3.59 57.05,52.95 65.9,61.8 65.9,67.86 J12.8
P9_05
  Top 0.2: U3.73 58.85,59.95 60.75,61.85 60.75,67.93 J12.4
P9_06
  Top 0.2: U3.72 59.95,59.45 62.08,61.58 J12.5
P9_07
  Top 0.2: U3.71 60.95,58.95 63.35,61.35 63.35,67.87 J12.6
P9_08
  Top 0.2: U3.70 61.25,58.45 64.62,61.82 J12.7
PB_00  (via drill 0.2 layers 1-3)
  Top 0.254: v30.31,46.39 30.05,46.13 U3.16
  Route3 0.2: v30.31,46.39 26.75,42.83 12.57,42.83 9.47,39.73 J4.P$12
R51
  Top 0.2: R25.P$1 U$2.12
R52
  Top 0.2: R26.P$1 U$2.9
RELAY_01  (via drill 0.35)
  Top 0.2: U3.56 59.49,51.45 v59.86,51.82
  Bottom 0.254: R102.P$1 59.84,51.8 v59.86,51.82
RELAY_02  (via drill 0.35)
  Top 0.2: v59.86,46.72 55.63,50.95 U3.55
  Bottom 0.254: R95.P$1 59.84,46.7 v59.86,46.72
RELAY_03  (via drill 0.35)
  Top 0.2: v59.86,41.52 51.93,49.45 U3.52
  Bottom 0.254: R85.P$1 59.84,41.5 v59.86,41.52
RELAY_04  (via drill 0.35)
  Top 0.2: v59.86,36.52 59.86,40.42 52.33,47.95 U3.49
  Bottom 0.254: R27.P$1 59.84,36.5 v59.86,36.52
RESET  (via drill 0.2 layers 1-14)
  Top 0.2: U3.67 51.37,56.95 C16.P$1 51.13,56.9 | 51.94,56.9 51.12,56.9 51.13,56.9 | 51.13,56.9 51.5,56.9 | 51.5,56.9 R13.P$1 | v52,57.9 51.5,57.4 51.5,56.9
  Route14 0.2: J3.9 67.16,72.86 66.3,72 54,72 52,70 v52,57.9
REXT
  Top 0.2: U6.9 22.25,27.35 25.06,30.16 C49.P$1 R74.P$2
RXD0
  Top 0.2: U6.13 19.8,30.9 R107.P$2
RXD1
  Top 0.2: U6.12 21.45,28.85 23.5,30.9 R101.P$2
RXER
  Top 0.2: U6.17 17.8,30.9 16.7,32 R108.P$2
RXM
  Top 0.2: U$2.6 18.3,21.01 U6.3
RXP  (via drill 0.2 layers 1-3)
  Top 0.2: U6.4 18.8,23 v19.3,22.5
  Route3 0.2: v19.3,22.5 17.9,22.5 15.59,20.19 U$2.3
SD1_CD
  Top 0.2: U3.146 20.61,60.97 17.36,60.97 14.3,64.03 14.3,74.1 12.57,75.83 J1.10
SD1_CLK  (via drill 0.2 layers 1-14)
  Top 0.2: U3.140 21.95,63.95 v22,64 | v3.4,71.4 J1.5
  Route14 0.2: v22,64 22.7,64.7 22.7,68.1 19.4,71.4 v3.4,71.4
SD1_CMD  (via drill 0.2 layers 1-3)
  Top 0.2: U3.141 17.32,63.45 v17.09,63.69 | v3.4,69.2 J1.3
  Route3 0.2: v17.09,63.69 16.09,63.69 12.17,67.6 8.2,67.6 6.6,69.2 v3.4,69.2
SD1_DAT0  (via drill 0.2 layers 1-3)
  Top 0.2: J1.7 v3.4,73.6 | U3.142 v19.2,62.95
  Route3 0.2: v3.4,73.6 5.8,71.2 9.8,71.2 15.65,65.35 16.4,65.35 18.8,62.95 v19.2,62.95
SD1_DAT1  (via drill 0.2 layers 1-3)
  Top 0.2: U3.143 21.95,62.45 v22,62.4 | v3.4,74.7 J1.8
  Route3 0.2: v22,62.4 22,63 21,64 18.9,64 8.2,74.7 v3.4,74.7
SD1_DAT2  (via drill 0.2 layers 1-3)
  Top 0.2: J1.1 v3.7,67 | U3.144 18.95,61.95 v18.9,62
  Route3 0.2: v3.7,67 7.2,63.5 13.8,63.5 15.3,62 v18.9,62
SD1_DAT3  (via drill 0.2 layers 1-3)
  Top 0.2: J1.2 2.12,68.2 v3.6,68.2 | U3.145 18.55,61.45 v17.2,62.8
  Route3 0.2: v17.2,62.8 15.6,62.8 12.1,66.3 7.2,66.3 5.3,68.2 v3.6,68.2
SD1_WP
  Top 0.2: U3.147 16.05,60.45 12.82,63.67 J1.9
TCK
  Top 0.2: U3.88 52.85,67.45 55.8,70.4 62.2,70.4 64.62,72.82 J3.7
TDI
  Top 0.2: U3.91 43.05,70.75 44.4,72.1 56.3,72.1 57,72.8 J3.1
TDO
  Top 0.2: U3.90 43.55,70.35 44.7,71.5 58.6,71.5 59.54,72.44 J3.3
TMS
  Top 0.2: J3.5 62.08,71.88 60.98,70.78 44.85,70.78 44.05,69.97 U3.89
TXM  (via drill 0.2 layers 1-3)
  Top 0.2: v19.6,23.4 19.3,23.7 U6.5
  Route3 0.2: U$2.2 17.82,23.4 v19.6,23.4
TXP  (via drill 0.2 layers 1-3)
  Top 0.2: U6.6 19.8,24.4 v20.1,24.1
  Route3 0.2: v20.1,24.1 15.7,24.1 13.05,21.45 U$2.1
USB_N  (via drill 0.2 layers 1-14)
  Top 0.2: R17.P$1 46.75,15.4 | 46.75,15.4 U5.2 | U5.3 U5.2 | U5.2 46.75,15.4 | U5.2 46.75,16.05 44.7,18.1 v44.7,18.5
  Top 0.254: U3.46 42.8,46.45 v42.8,46.5
  Route14 0.254: v42.8,46.5 44.7,44.6 v44.7,18.5
USB_P  (via drill 0.2 layers 1-14)
  Top 0.2: v45.2,19 45.2,18.6 47.25,16.55 U5.1 U5.5 47.25,12.4 47.75,11.9 47.75,11.05 R18.P$1
  Top 0.254: U3.47 43.45,46.95 v43.4,47
  Route14 0.254: v43.4,47 45.2,45.2 v45.2,19
USB_VBUS_B
  Top 0.2: R16.P$1 45.6,16.1 44.05,17.43 U3.44
USBHS_FAULT  (via drill 0.2 layers 1-14)
  Top 0.254: U2.3 32.2,19.8 R19.P$1 32.77,21.77 v33.4,21.77 | U3.78 39.1,62.45 v39.05,62.4
  Route14 0.2: v39.05,62.4 33.4,56.75 v33.4,21.77
USBHS_N  (via drill 0.2 layers 1-14)
  Top 0.2: J6.D- 34,15.5 35.5,17 U4.2 | U4.2 U4.3 | U4.2 v35.5,26
  Top 0.254: U3.31 37.56,45.23 36.18,46.6 v35.5,46.6
  Route14 0.254: v35.5,46.6 v35.5,26
USBHS_P  (via drill 0.2 layers 1-14)
  Top 0.2: J6.D+ U4.5 U4.1 v36,26.5
  Top 0.254: U3.32 38.05,45.75 36.7,47.1 v36,47.1
  Route14 0.254: v36,47.1 v36,26.5
USBHS_VBUS  (via drill 0.2 layers 1-14)  (1 unrouted)
  Top 0.152: v30.4,15.1 v30.41,15.11 | 32,14.1 J6.VBUS | U3.17 v30.55,42.7
  Top 0.254: 32,14.1 32.65,14.76 32.65,15.76 U2.5 | 28.9,15 C29.P$1 30.3,15.11 | v30.4,15.1 30.5,15.1 J6.VBUS
  Top 0.508: U2.5 34.2,17.2 | C1.1 29.94,16.14 C29.P$1
  Route14 0.152: v30.55,42.7 30.55,39.5 29.7,38.65 29.7,36.1 30.4,35.4 v30.4,15.1
USBHS_VBUSEN
  Top 0.254: R20.P$1 34.15,22.55 U2.1
VBUS
  Top 0.2: J7.P$1 45.7,6 45.5,6.2 R21.P$2 C28.P$1 45.5,9.7 R16.P$2
VCL_F(FLASH)
  Top 0.2: U3.112 32.55,73.05 32.89,73.39 C34.P$2
VDD  (via drill 0.2, 0.2 layers 1-15, 0.2 layers 15-16, 0.25 layers 1-15, 0.35 layers 1-15)  (35 unrouted)
  Top 0.2: U3.149 20.61,59.43 | R75.P$2 v15.69,33.39 v15.7,33.4 | R87.P$2 v9.21,27.66 v9.2,27.65 | U6.14 19.3,31.7 C51.P$1 C50.1 v20.1,35.5 | R100.P$2 27.54,33.04 v27.7,33.2 26.85,34.05 R94.P$2 | R26.P$2 9.29,4.1 v10.4,4.1 | R25.P$2 25.58,4.1 v25.1,4.1 | R5.P$2 v7.31,23.59 v7.3,23.6 | C27.P$2 17.89,48.45 U3.171 22.05,48.45 v22.1,48.5 | U3.48 v47.35,47.45 47.61,47.19 C43.P$2 | C39.P$1 v39.19,42.36 39.05,42.5 U3.34 | v34.83,42.45 35.53,41.75 37.1,41.75 C36.P$1 | U3.84 46.95,65.45 47.26,65.14 C41.P$1 | U3.123 27.05,70.75 v26.85,70.95 26.85,71.9 C30.P$2 | U3.110 33.53,69.39 33.53,70.22 33.3,70.44 v33.3,70.65 C35.P$2 | U3.97 40.05,70.55 v39.9,70.7 39.89,70.71 C38.P$2 | J1.4 v3.4,70.3 | U3.138 v19.25,64.95 18.88,65.32 C20.P$2 | R13.P$2 52.57,55.75 53.44,55.75 C40.P$1 53.48,54.62 v53.5,54.6
  Top 0.254: v47.4,53.75 47.2,53.95 U3.61 | U3.25 34.55,42.73 v34.83,42.45 35.05,42.68 U3.26 | 21.25,75.5 R14.P$1 21.2,75.48 v21.2,74.4 21.2,73.55 R15.P$1 | U3.158 17.87,54.95 C25.P$2 17.74,56.03 | 17.74,56.03 C21.P$2 C22.P$2 | C22.P$2 | U3.154 19,56.95 | 19,56.95 17.85,56.95 C22.P$2 | U3.155 19.5,56.45 19,56.95 | v18.7,56 17.77,56 17.74,56.03 | C19.P$2 18.62,58.75 19.33,59.45 U3.149 21.85,59.45 v22,59.6
  Bottom 0.254: v10.1,17.9 9.2,17.9 L1.2 9.1,17.3 | 9.1,17.3 9.1,17.2 | 9.1,17.2 9.6,16.7 v10.1,16.7 | v10.1,19.1 9.1,19.1 9.1,18.5 v10.1,18.5 | v34.83,42.45 34.9,42.52 | v61.8,7.7 62.1,8 U7.3 | v54,7.7 54.3,8 U42.3 | v62,12.9 62.3,13.2 U44.3 | v54,12.9 54.3,13.2 U49.3 | v62,18.2 62.3,18.5 U51.3 | v54,18.2 54.3,18.5 U8.3 | v62,23.4 62.3,23.7 U48.3 | v54,23.4 54.3,23.7 U52.3 | v62,28.8 62.3,29.1 U54.3 | v54,28.8 54.3,29.1 U56.3 | v10.05,16.1 9.6,16.1 9.1,16.6 9.1,17.2 | v10.1,17.3 9.1,17.3 | v9.9,19.75 9.55,19.75 9.1,19.3
  Bottom 0.508: C7.P$1 8.2,20.4 9.1,20.4 | C5.P$1 8.2,21.4 9.1,21.4 | C4.P$1 9.05,22.35 9.1,22.3
  Bottom 0.813: L1.2 9.1,18.5 9.1,19.3 9.1,20.4 9.1,21.4 9.1,22.3
VDD5  (via drill 0.2, 0.25 layers 1-15)
  Top 0.254: R20.P$2 32.3,22.7 31,21.4 R19.P$2 30.85,21.05 C23.P$1 C26.P$1 v27.65,21.05 | R73.P$2 66.26,33.46 67.2,34.4 J25.1 | R86.P$2 66.26,38.46 67.2,39.4 J32.1 | R96.P$2 66.26,43.66 67.2,44.6 J36.1 | R106.P$2 66.26,48.76 67.2,49.7 J38.1
  Top 0.508: v31.33,16.7 31.7,16.7 U2.4
  VDD 0.508: v27.65,21.05 30.15,21.05 31.33,19.87 v31.33,16.7 31.33,1.69 31.5,1.52 | J38.1 J36.1 J32.1 J25.1
  VDD 0.61: J25.1 67.58,35.3 68.68,34.2 68.68,6.78 63.65,1.75 51.35,1.75 51.13,1.52
  VDD 1.016: J2.P$3 5.5,14.38 7.64,12.24 7.64,3.68 9.8,1.52 31.5,1.52 51.13,1.52
VDD_1.2
  Top 0.2: C48.P$1 C47.P$1 16.72,23.22 17.3,23.8 U6.1
VDD_ENET1
  Top 0.2: FB2/2.2 10.37,22.67 12.24,22.67 C45.1 12.48,22.47 C46.P$1 17.07,22.47 17.8,23.2 U6.2
VDDIN  (1 unrouted)
  Bottom 1.016: J2.P$2 6.51,18.19 6.82,17.88
XCIN
  Top 0.254: X3.P$1 31.55,37.26 32.04,37.75 32.04,38.27 C32.P$1 33.35,39.58 33.35,40.92 32.05,42.23 U3.20
XCOUT
  Top 0.254: U3.21 32.55,42.51 34.03,41.02 34.03,40.48 C37.P$1 34.43,38.34 X3.P$2
XII
  Top 0.2: C44.P$1 25.6,27.71 U$3.1 25.05,26.85 U6.8
XOO
  Top 0.2: U6.7 23.75,26.35 24.2,25.9 26.3,25.9 27.1,25.1 U$3.3 27.1,23.1 C15.P$1
XTAL1
  Top 0.254: X2.1 36.54,34.99 37.3,35.75 37.3,38.53 C17.P$1 36.6,39.23 36.6,40.5 36.24,40.86 34.87,40.86 33.55,42.18 U3.23
XTAL2
  Top 0.254: X2.3 38.4,36.9 38.4,38.62 38.13,38.88 C18.P$1 37.96,39.05 37.16,39.86 37.16,40.54 36.33,41.37 34.98,41.37 34.05,42.3 U3.24

## Text on the board
tNames: 2 | 1 | VDD | Titan | 2 | 1 | 9 | 10 | GND | 2 | 10 | 9 | 1 | 1 | 2 | 19 | 20 | GND | 3.3V | 5V | E
bNames: Titan 1p7